# Altium project obc_ver2.PrjPcb (part 1 of 3)
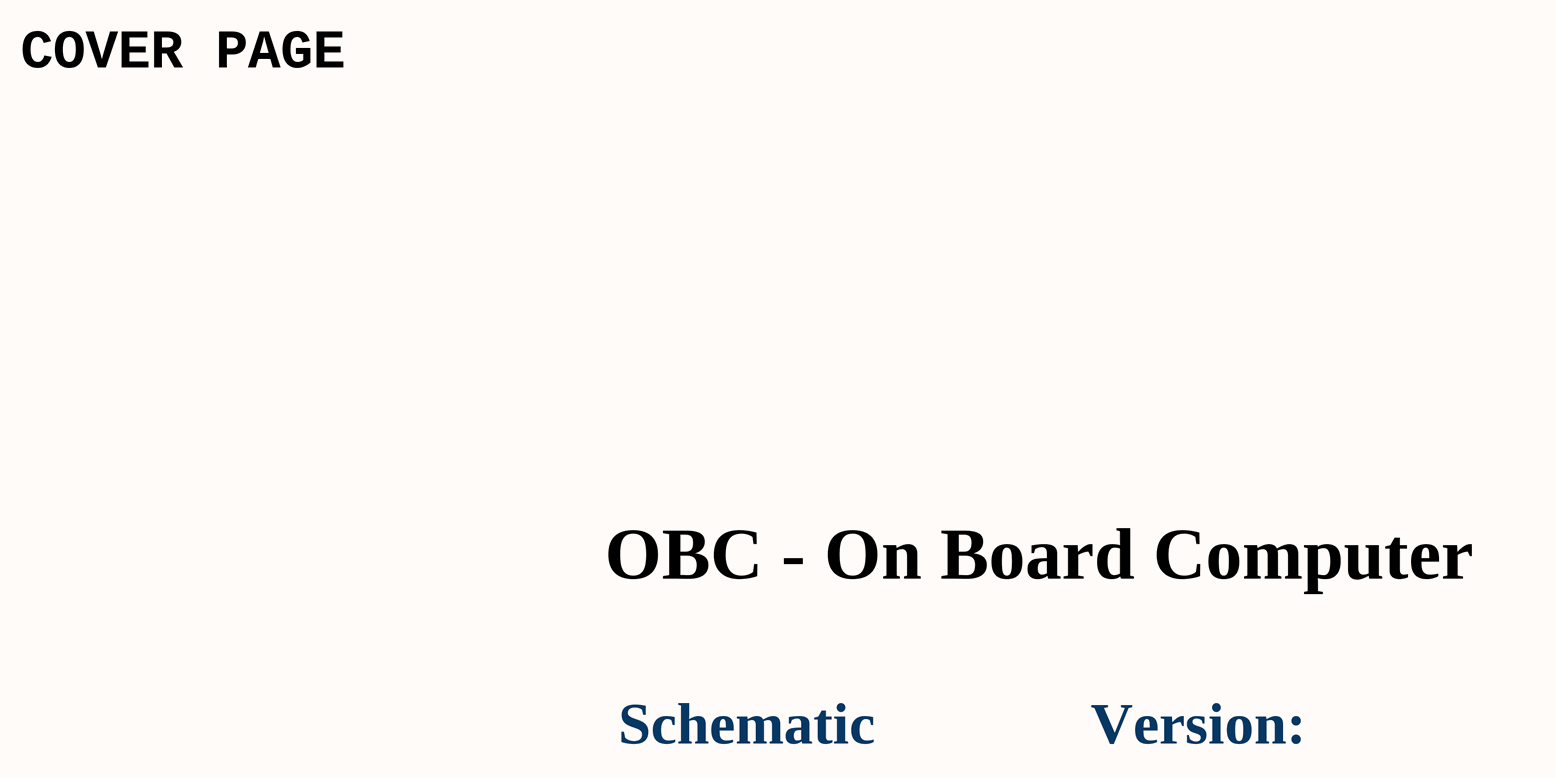
[diagram p0: obc-v2_COVER-PAGE.SchDoc]
21 sheets, 425 parts. Net scope: flat (ports and power ports of the same name join across sheets).
Board file: OBC_Ver2.PcbDoc
Sheets:
  obc-v2_COVER-PAGE.SchDoc
  obc-v2_INDEX.SchDoc
  obc-v2_POWER.SchDoc
  obc-v2_OUT-eMMC.SchDoc
  obc-v2_TMP-eMMC.SchDoc
  obc-v2_RTC-WDOG.SchDoc
  obc-v2_FRAM-FLASH.SchDoc
  obc-v2_BOARD-CONNECT.SchDoc
  obc-v2_DEBUG.SchDoc
  obc-v2_USB-HUB.SchDoc
  obc-v2_EXP-I2C-IRQ.SchDoc
  obc-v2_EXP-CAN-RS422.SchDoc
  obc-v2_CM4-M2.SchDoc
  obc-v2_CM4-PinOut.SchDoc
  obc-v2_CM4-SPI-UART.SchDoc
  obc-v2_CM4-IRQ-CTRL.SchDoc
  obc-v2_CM4-FUNCTION.SchDoc
  obc-v2_CM4-CSI.SchDoc
  obc-v2_CM4-POWER.SchDoc
  obc-v2_MCU-POWER.SchDoc
  obc-v2_MCU-PinOut.SchDoc

## Sheet obc-v2_COVER-PAGE.SchDoc
size 420 x 297 mm; SheetNumber: 1; SheetTotal: 23

### Notes on the sheet
- COVER PAGE
- OBC - On Board Computer
- Schematic
- Version:
- Project:
- Sub-system:
- Design by:
- Sheet title:
- Sheet
- A3
- of
- Checked by:
- Approved by:
- Revision:
- Document No:
- Size:
- Date:

## Sheet obc-v2_INDEX.SchDoc
size 420 x 297 mm; SheetNumber: 2; SheetTotal: 23
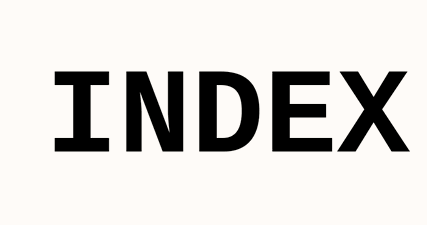
[diagram p1: obc-v2_INDEX.SchDoc]

### Notes on the sheet
- INDEX
- Project:
- Sub-system:
- Design by:
- Sheet title:
- Sheet
- A3
- of
- Checked by:
- Approved by:
- Revision:
- Document No:
- Size:
- Date:

## Sheet obc-v2_POWER.SchDoc
size 420 x 297 mm; SheetNumber: 3; SheetTotal: 21
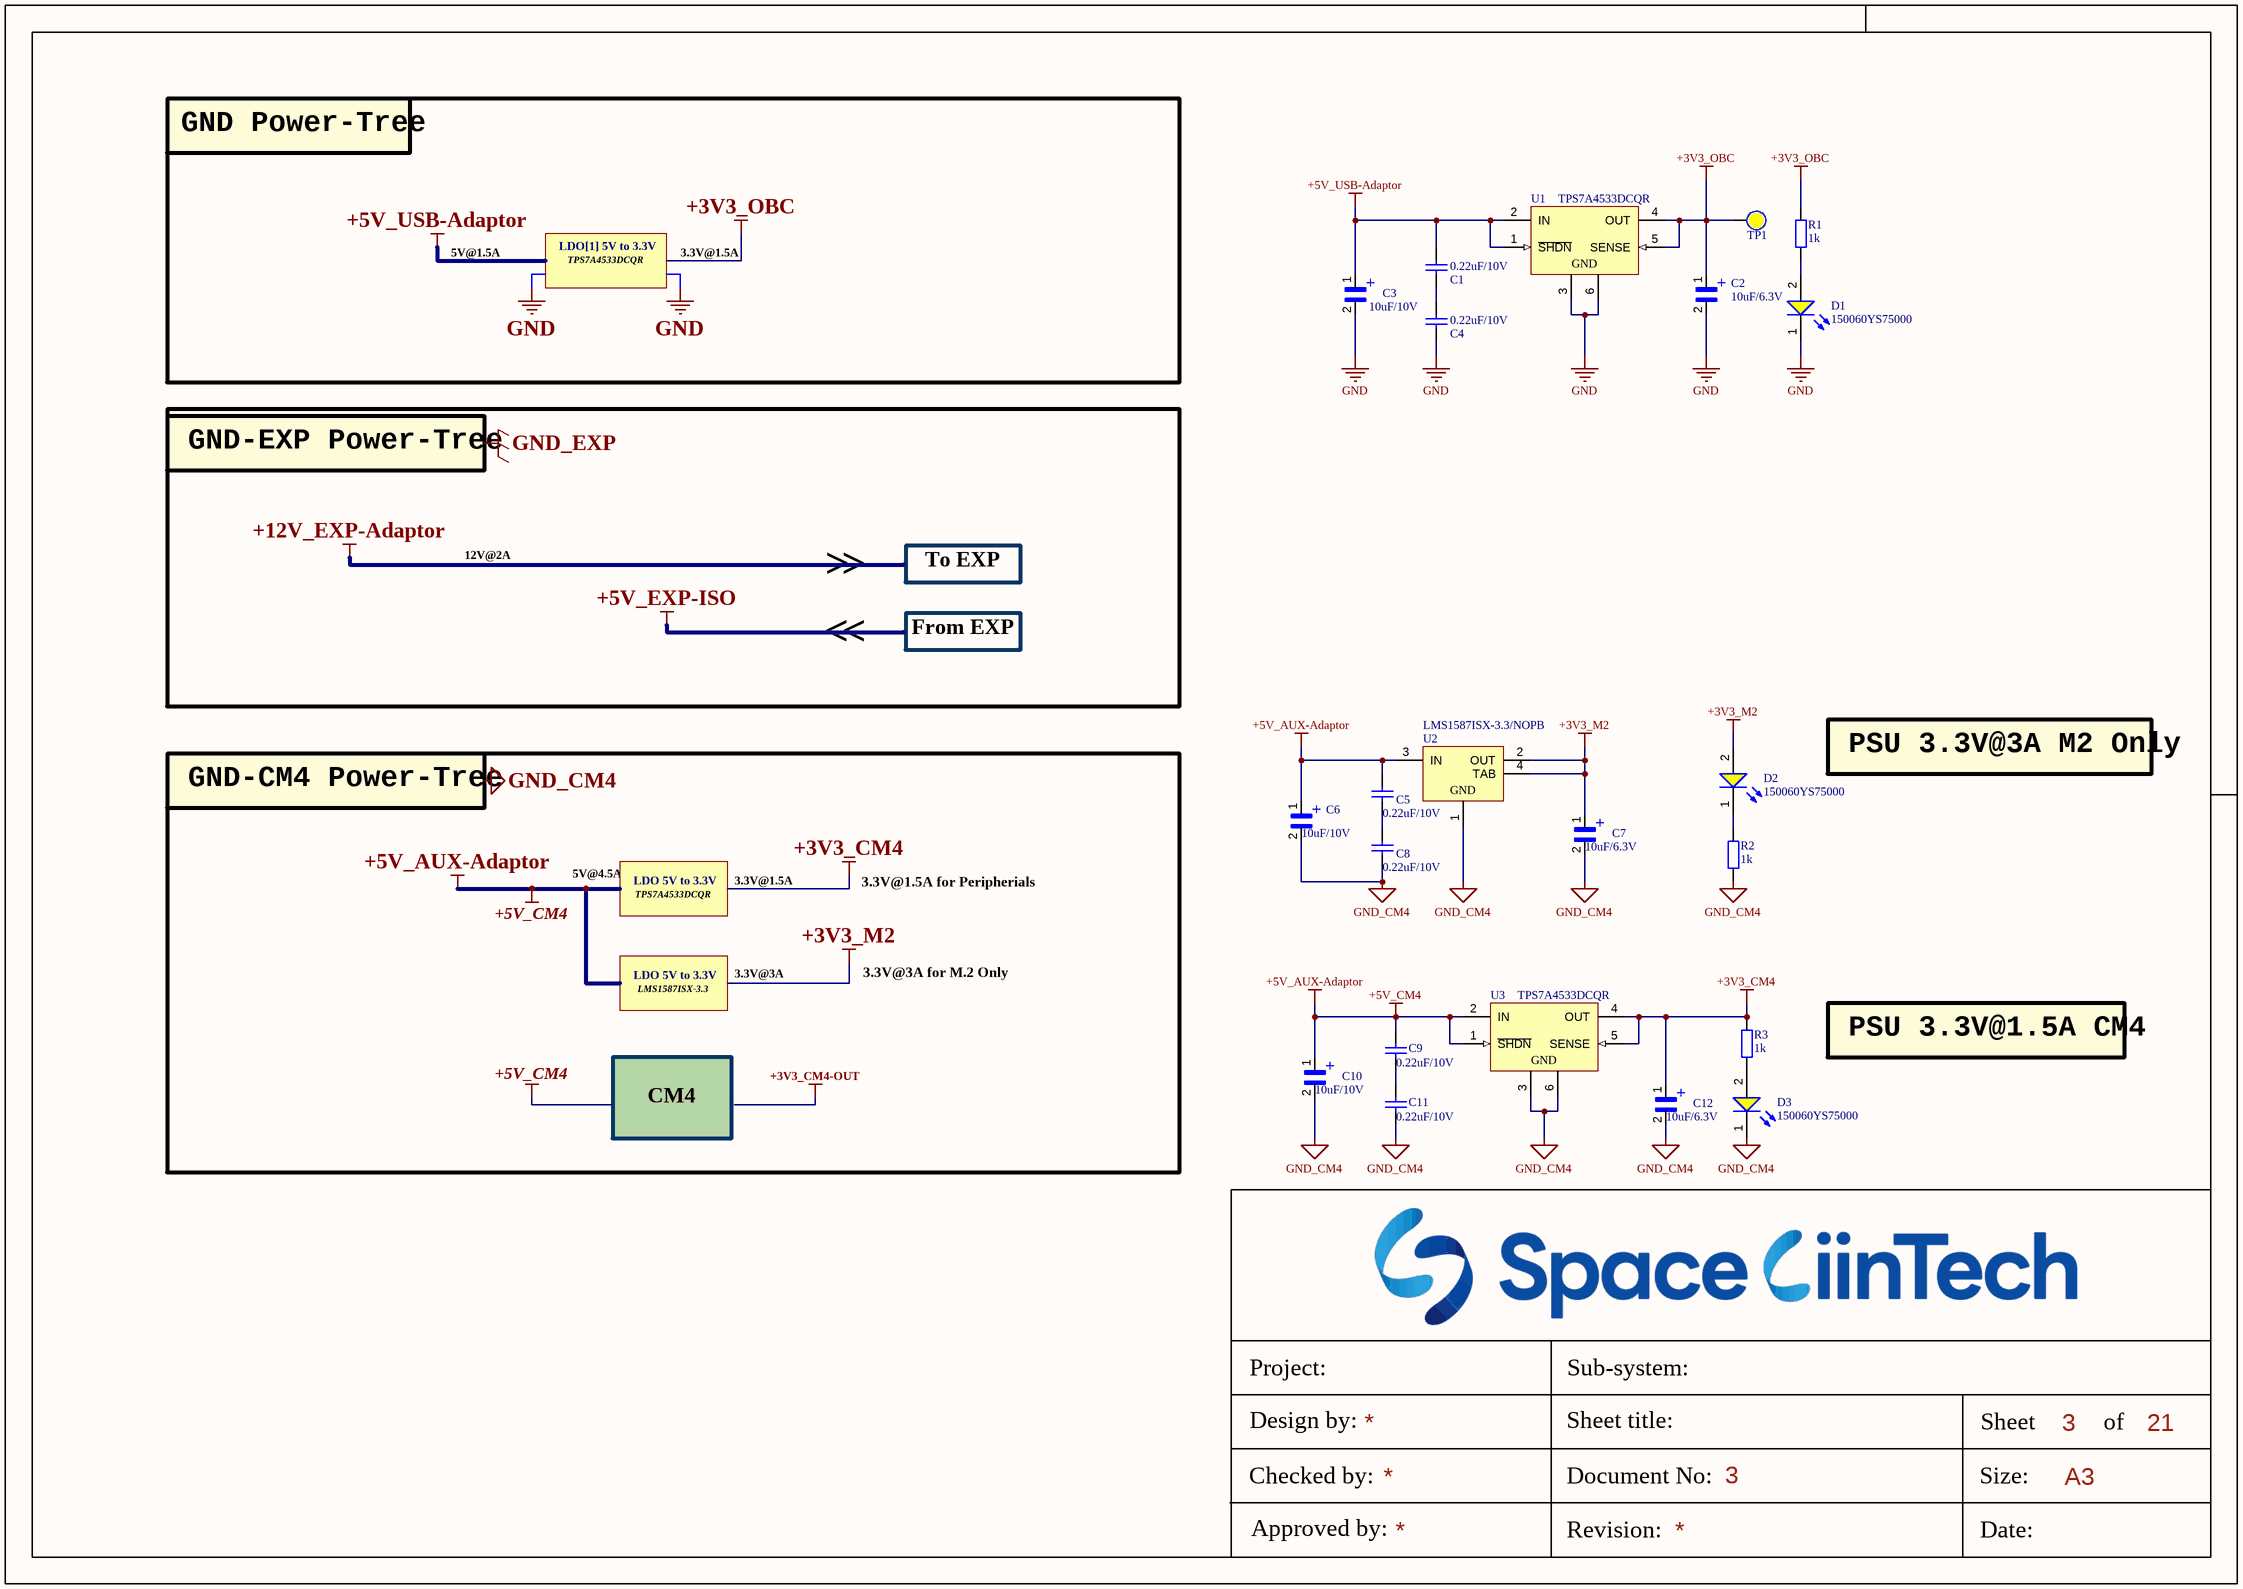
[diagram p2: obc-v2_POWER.SchDoc]

### Parts
C1  0.22uF/10V  [CAP_C_1005X60]
C2  10uF/6.3V  [CAP_MP_2012X170]
C3  10uF/10V  [CAP_MP_2012X170]
C4  0.22uF/10V  [CAP_C_1005X60]
C5  0.22uF/10V  [CAP_C_1005X60]
C6  10uF/10V  [CAP_MP_2012X170]
C7  10uF/6.3V  [CAP_MP_2012X170]
C8  0.22uF/10V  [CAP_C_1005X60]
C9  0.22uF/10V  [CAP_C_1005X60]
C10  10uF/10V  [CAP_MP_2012X170]
C11  0.22uF/10V  [CAP_C_1005X60]
C12  10uF/6.3V  [CAP_MP_2012X170]
D1  150060YS75000  [WL-SMCW_0603_150060xx75000]
D2  150060YS75000  [WL-SMCW_0603_150060xx75000]
D3  150060YS75000  [WL-SMCW_0603_150060xx75000]
R1  1k  [RES_C_1608X60]
R2  1k  [RES_C_1608X60]
R3  1k  [RES_C_1608X60]
TP1  (no value)  [Test Point 1 Side]  (no BOM)
U1  TPS7A4533DCQR  [DCQ0006A_M]
U2  LMS1587ISX-3.3/NOPB  [TS3B_L]
U3  TPS7A4533DCQR  [DCQ0006A_M]

### Nets
+3V3_CM4: C12.1 R3.2 U3.4(OUT) U3.5(SENSE)
+3V3_M2: C7.1 D2.2(A) U2.2(OUT) U2.4(TAB)
+3V3_OBC: C2.1 R1.2 TP1.0 U1.4(OUT) U1.5(SENSE)
+5V_AUX-Adaptor: C5.1 C6.1 C9.1 C10.1 U2.3(IN) U3.1(~{SHDN}) U3.2(IN)  [also labelled +5V_CM4]
+5V_USB-Adaptor: C1.1 C3.1 U1.1(~{SHDN}) U1.2(IN)
GND: C2.2 C3.2 C4.2 D1.1(K) U1.3(GND) U1.6(GND)
GND_CM4: C6.2 C7.2 C8.2 C10.2 C11.2 C12.2 D3.1(K) R2.2 U2.1(GND) U3.3(GND) U3.6(GND)
NetC1_2: C1.2 C4.1
NetC5_2: C5.2 C8.1
NetC9_2: C9.2 C11.1
NetD1_2: D1.2(A) R1.1
NetD2_1: D2.1(K) R2.1
NetD3_2: D3.2(A) R3.1

### Notes on the sheet
- GND Power-Tree
- 5V@1.5A
- LDO[1] 5V to 3.3V
- TPS7A4533DCQR
- 3.3V@1.5A
- GND-EXP Power-Tree
- 12V@2A
- >
- To EXP
- <
- From EXP
- GND-CM4 Power-Tree
- PSU 3.3V@3A M2 Only
- 5V@4.5A
- LDO 5V to 3.3V
- 3.3V@1.5A for Peripherials
- LMS1587ISX-3.3
- 3.3V@3A
- 3.3V@3A for M.2 Only
- PSU 3.3V@1.5A CM4
- CM4
- Labels drawn without touching a wire or pin: GND, GND_CM4, GND_EXP
- Project:
- Sub-system:
- Design by:
- Sheet title:
- Sheet
- A3
- of
- Checked by:
- Approved by:
- Revision:
- Document No:
- Size:
- Date:
- (in symbol TACR686M003RTA) +

### Library data of the parts
C1 C4 C5 C8 C9 C11 = Tu 0402 33nF 10V: CAPC; Chung_Loai: Dán; Don_Vi: Con; So_Chan: 2; Ten_Linh_Kien: Tụ 0402 33nF X7R 10V GRM155R71A333KA01D; Ma_Hang: MH007853; Kieu_Chan: *
C2 C3 C6 C7 C10 C12 = TACR686M003RTA: CAPP; MF: AVX; Availability: Unavailable; SnapEDA_Link: https://www.snapeda.com/parts/TACR686M003RTA/AVX/view-part/1745975/?ref=snap; MP: TACR686M003RTA; Value: *; Price: None; Package: 0805 AVX
D1-D3 = CMP-1426-00005-2: LED YELLOW CLEAR 0603 SMD; NexarPartId: 29687085; Wavelength: 590nm; Luminous Intensity: 120mcd; Peak Wavelength: 595nm; Forward Current: 100mA; Power Dissipation: 72mW; Forward Voltage: 2V; Test Current: 20mA; Reverse Voltage: 5V; Lens Style: Clear, Rectangular; Max Junction Temperature (Tj): 95°C; Viewing Angle: 140°; Case Code (Imperial): 0603; Height: 700µm; REACH SVHC: Unknown; Dominant Wavelength: 590nm; Min Operating Temperature: -40°C; Color: Yellow; Width: 800µm; Mount: Surface Mount; Packaging: Tape and Reel; Max Operating Temperature: 85°C; RoHS: Compliant; Max Reverse Voltage (DC): 5V; Case Code (Metric): 1608; Length: 1.6mm; Case/Package: 0603
R1-R3 = Tro 0603 1% 10k: RES; Chung_Loai: Dán; Don_Vi: Con; So_Chan: 2; Ten_Linh_Kien: Trở 0603 1% 10k; Ma_Hang: MH006333; Kieu_Chan: *
TP1 = Test Point: Solder: NF
U1 U3 = CMP-0395-00360-2: Single Output Fast Transient Response LDO, 1.5 A, Fixed 3.3 V Output, 2.1 to 20 V Input, 6-pin SOT-223 (DCQ), -40 to 125 degC, Green (RoHS & no Sb/Br); Manufacturer: Texas Instruments; Vout Adj(Max)(V): 3.3; Vin(Max)(V): 20; Accuracy(%): 1; SubFamily: Single Channel LDO; Vin(Min)(V): 2.1; Iout(Max)(A): 1.5; Vdo(Typ)(mV): 300; Eco-Plan: Green (RoHS & no Sb/Br); Mounting Technology: Surface Mount; PackageDescription: 6-Pin Plastic Small Outline, Body 3.5 x 6.5 mm, Pitch 1.27 mm; ComponentLink2URL: http://www.ti.com/general/docs/lit/getliterature.tsp?genericPartNumber=TPS7A4533&fileType=pdf; PackageReference: DCQ0006A; ComponentLink3Description: Package Specification; ComponentLink2Description: Datasheet; Fixed Output Options(V): 3.3; Iq(Typ)(mA): 1; ComponentLink1URL: http://www.ti.com/; PartNumber: TPS7A4533DCQR; ComponentLink1Description: Manufacturer URL; PackageVersion: 4202109/D; Vout Adj(Min)(V): 3.3; DatasheetVersion: SLVS720D; ComponentLink3URL: http://www.ti.com/litv/pdf/mpds098c
U2 = CMP-0062-00180-3: 3A Low Dropout Fast Response Regulators, 3-pin TO-263, Pb-Free; Manufacturer: National Semiconductor; PowerWise: N; High-Reliability: Y; PackageTopMarking: NSUZXYTTE#*LMS1587*IS-3.3; CompType: LDO IC; ComponentLink1Description: Manufacturer URL; PackageReference: TS3B; ComponentLink1URL: http://www.national.com/; ComponentLink2URL: http://www.national.com/ds/LM/LMS1587.pdf; DatasheetVersion: Jun-2005; ComponentLink3URL: http://www.national.com/pf/LM/LMS1587.html; PartNumber: LMS1587ISX-3.3/NOPB; RevisionNote: SCH symbol layout adjusted; PinCount: 3; RoHS: Y; Code_JEDEC: MO-169-AA; PackageDescription: TO-263, Molded, .400 x .390 x .180in, 3 Lead, .1in Pitch, Surface Mount; ComponentLink4Description: TS3B Package Page; ComponentLink3Description: LMS1587 Web Page; PackageVersion: revF, Apr-2005; ComponentLink2Description: LMS1587 Datasheet; ComponentLink4URL: http://www.national.com/packaging/folders/ts3b.html

## Sheet obc-v2_OUT-eMMC.SchDoc
size 420 x 297 mm; SheetNumber: 4; SheetTotal: 21
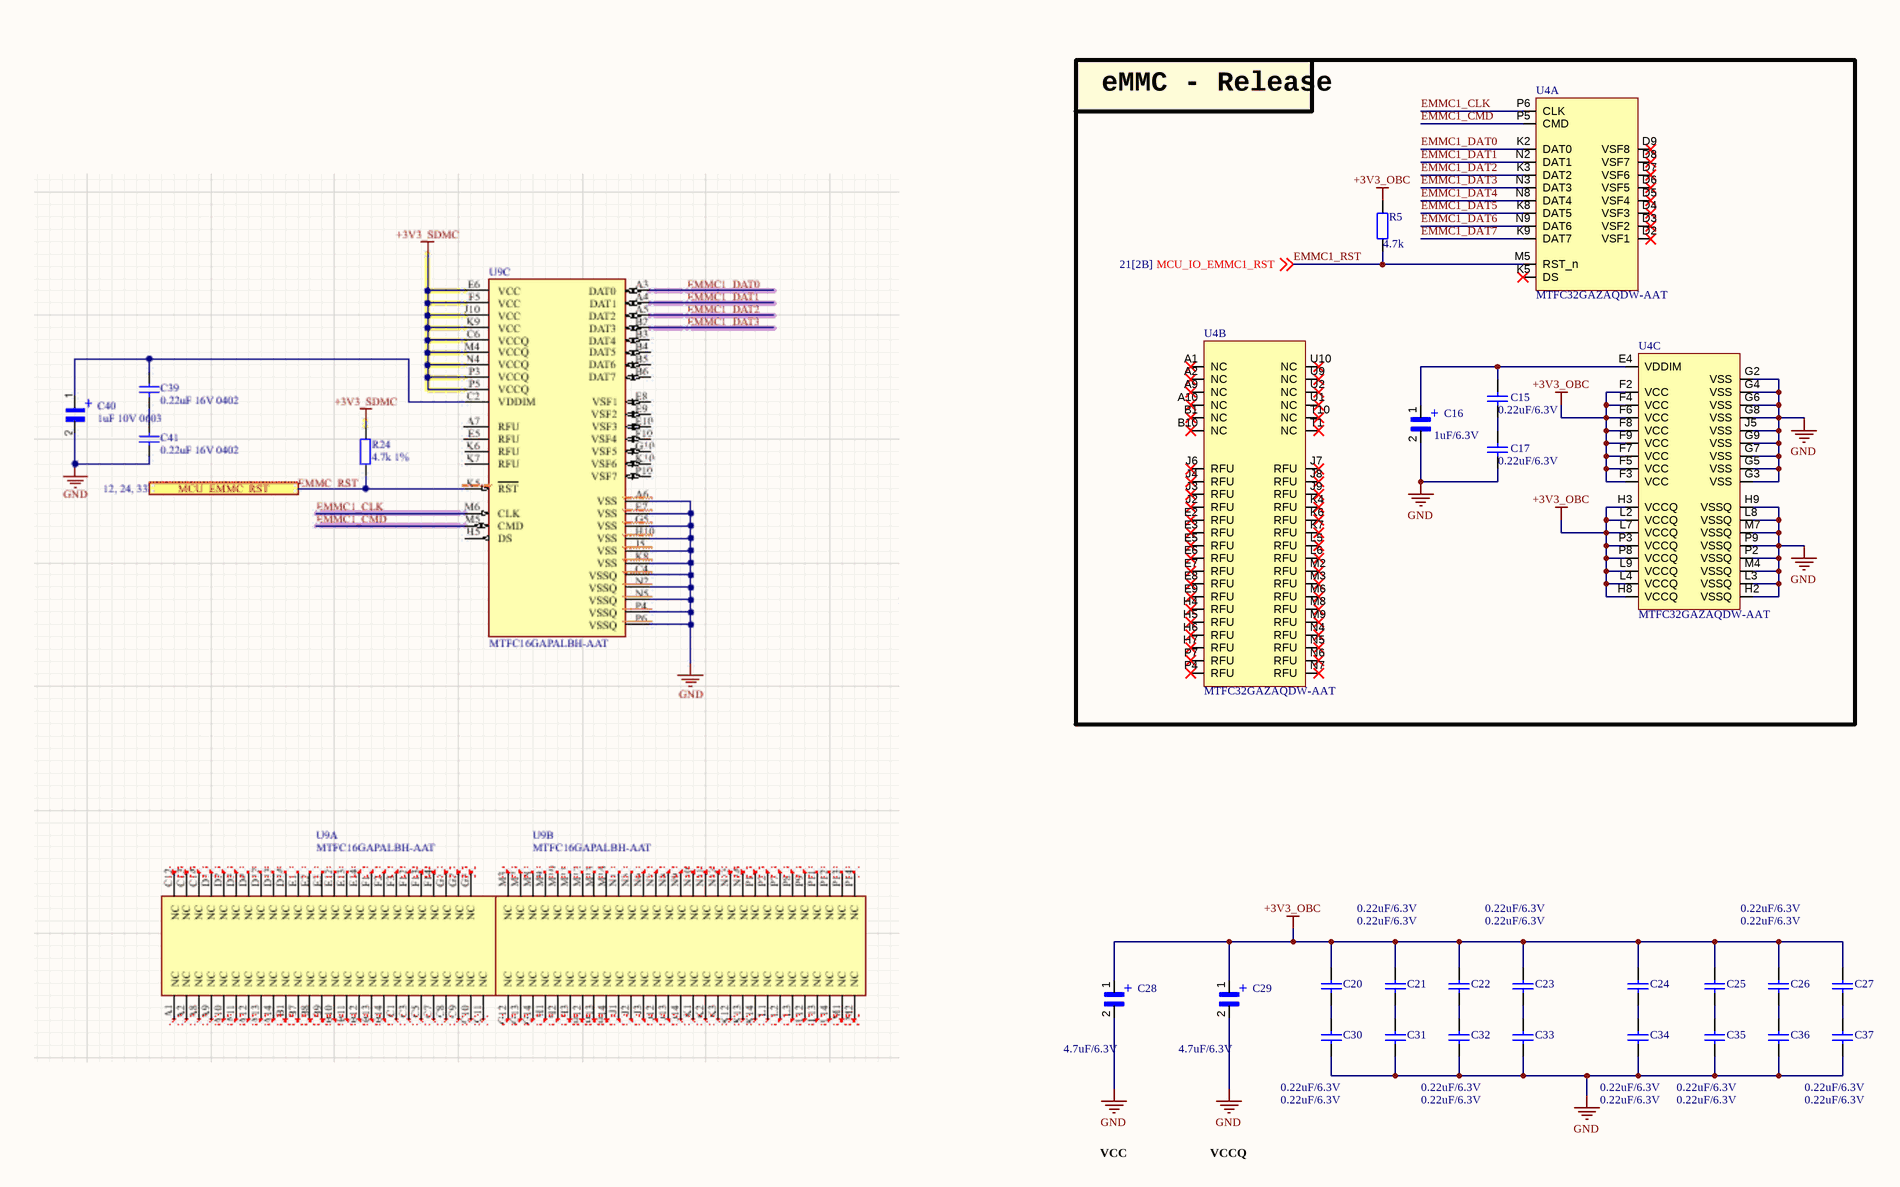
[diagram p3: obc-v2_OUT-eMMC.SchDoc, left]
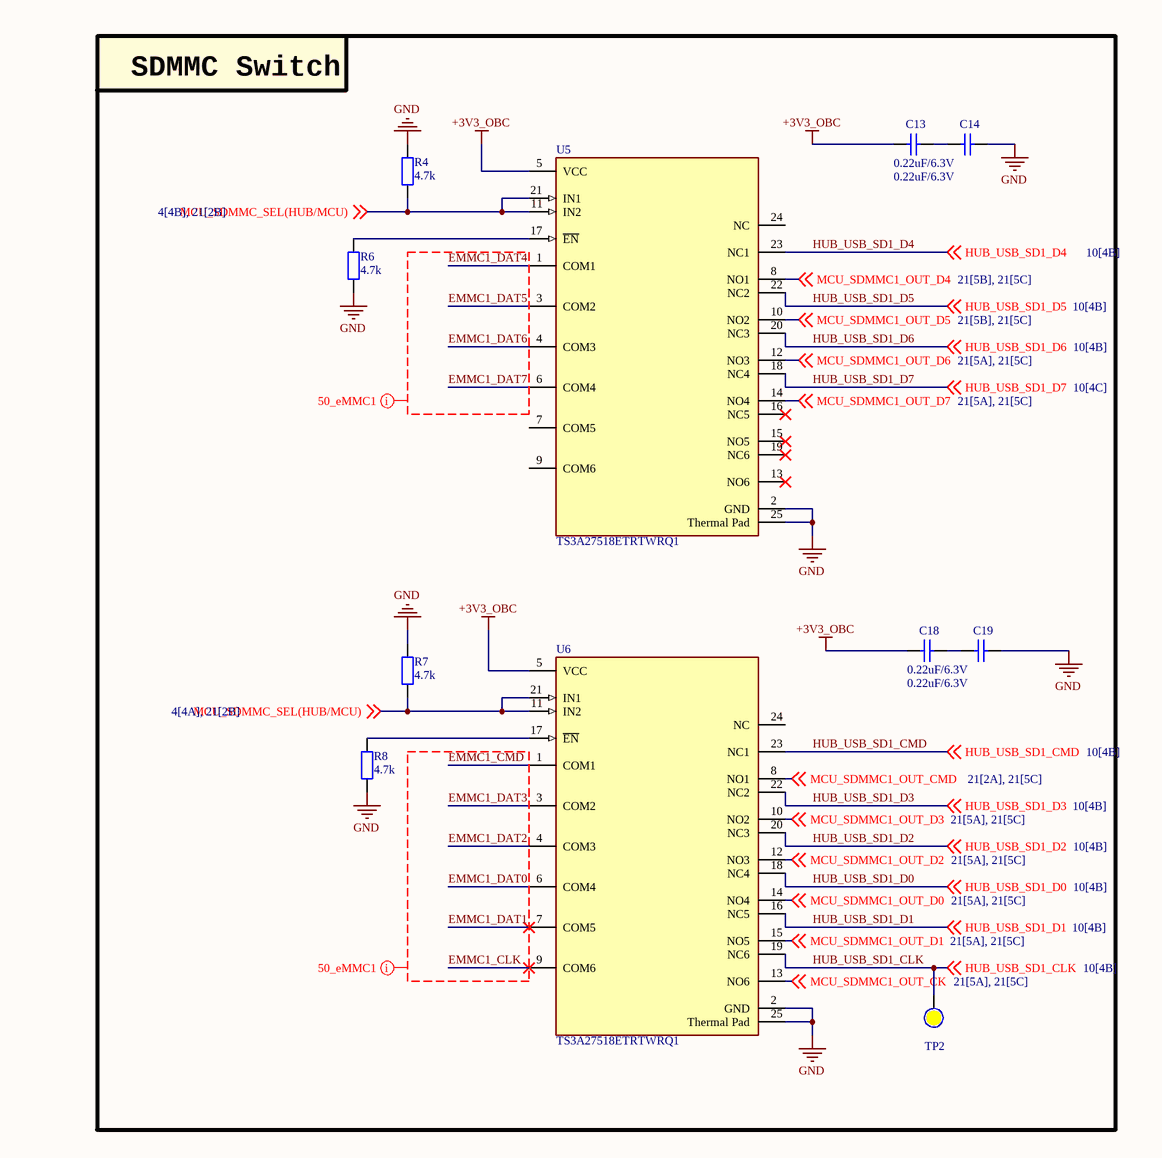
[diagram p4: obc-v2_OUT-eMMC.SchDoc, right]

### Parts
C13  0.22uF/6.3V  [CAP_C_1005X60]
C14  0.22uF/6.3V  [CAP_C_1005X60]
C15  0.22uF/6.3V  [CAP_C_1005X60]
C16  1uF/6.3V  [CAP_MP_1608X90]
C17  0.22uF/6.3V  [CAP_C_1005X60]
C18  0.22uF/6.3V  [CAP_C_1005X60]
C19  0.22uF/6.3V  [CAP_C_1005X60]
C20  0.22uF/6.3V  [CAP_C_1005X60]
C21  0.22uF/6.3V  [CAP_C_1005X60]
C22  0.22uF/6.3V  [CAP_C_1005X60]
C23  0.22uF/6.3V  [CAP_C_1005X60]
C24  0.22uF/6.3V  [CAP_C_1005X60]
C25  0.22uF/6.3V  [CAP_C_1005X60]
C26  0.22uF/6.3V  [CAP_C_1005X60]
C27  0.22uF/6.3V  [CAP_C_1005X60]
C28  4.7uF/6.3V  [CAP_MP_1608X90]
C29  4.7uF/6.3V  [CAP_MP_1608X90]
C30  0.22uF/6.3V  [CAP_C_1005X60]
C31  0.22uF/6.3V  [CAP_C_1005X60]
C32  0.22uF/6.3V  [CAP_C_1005X60]
C33  0.22uF/6.3V  [CAP_C_1005X60]
C34  0.22uF/6.3V  [CAP_C_1005X60]
C35  0.22uF/6.3V  [CAP_C_1005X60]
C36  0.22uF/6.3V  [CAP_C_1005X60]
C37  0.22uF/6.3V  [CAP_C_1005X60]
R4  4.7k  [RES_C_1608X60]
R5  4.7k  [RES_C_1608X60]
R6  4.7k  [RES_C_1608X60]
R7  4.7k  [RES_C_1608X60]
R8  4.7k  [RES_C_1608X60]
TP2  (no value)  [Test Point 1 Side]  (no BOM)
U4  MTFC32GAZAQDW-AAT  [BGA_100_C_100P_10X17_1400X1800X150]  (parts A,B,C of 3)
U5  TS3A27518ETRTWRQ1  [FP-RTW0024B-IPC_A]
U6  TS3A27518ETRTWRQ1  [FP-RTW0024B-IPC_A]

### Blocks framed on the sheet
eMMC - Release: C15-C17 R5 U4
SDMMC Switch: C13 C14 C18 C19 R4 R6-R8 TP2 U5 U6

### Nets
+3V3_OBC: C13.2 C18.2 C20.1 C21.1 C22.1 C23.1 C24.1 C25.1 C26.1 C27.1 C28.1 C29.1 R5.1 U4.F2(VCC) U4.F3(VCC) U4.F4(VCC) U4.F5(VCC) U4.F6(VCC) U4.F7(VCC) U4.F8(VCC) U4.F9(VCC) U4.H3(VCCQ) U4.H8(VCCQ) U4.L2(VCCQ) U4.L4(VCCQ) U4.L7(VCCQ) U4.L9(VCCQ) U4.P3(VCCQ) U4.P8(VCCQ) U5.5(VCC) U6.5(VCC)
GND: C14.1 C16.2 C17.2 C19.1 C28.2 C29.2 C30.2 C31.2 C32.2 C33.2 C34.2 C35.2 C36.2 C37.2 R4.1 R6.2 R7.1 R8.2 U4.G2(VSS) U4.G3(VSS) U4.G4(VSS) U4.G5(VSS) U4.G6(VSS) U4.G7(VSS) U4.G8(VSS) U4.G9(VSS) U4.H2(VSSQ) U4.H9(VSSQ) U4.J5(VSS) U4.L3(VSSQ) U4.L8(VSSQ) U4.M4(VSSQ) U4.M7(VSSQ) U4.P2(VSSQ) U4.P9(VSSQ) U5.2(GND) U5.25(Thermal_Pad) U6.2(GND) U6.25(Thermal_Pad)
EMMC1_CLK: U4.P6(CLK) U6.9(COM6)
EMMC1_CMD: U4.P5(CMD) U6.1(COM1)
EMMC1_DAT0: U4.K2(DAT0) U6.6(COM4)
EMMC1_DAT1: U4.N2(DAT1) U6.7(COM5)
EMMC1_DAT2: U4.K3(DAT2) U6.4(COM3)
EMMC1_DAT3: U4.N3(DAT3) U6.3(COM2)
EMMC1_DAT4: U4.N8(DAT4) U5.1(COM1)
EMMC1_DAT5: U4.K8(DAT5) U5.3(COM2)
EMMC1_DAT6: U4.N9(DAT6) U5.4(COM3)
EMMC1_DAT7: U4.K9(DAT7) U5.6(COM4)
EMMC1_RST: R5.2 U4.M5(RST_n) ; off-sheet MCU_IO_EMMC1_RST  [also labelled MCU_IO_EMMC1_RST]
HUB_USB_SD1_CLK: TP2.0 U6.19(NC6) ; off-sheet HUB_USB_SD1_CLK  [project net HUB_SDMMC1_CLK]
HUB_USB_SD1_CMD: U6.23(NC1) ; off-sheet HUB_USB_SD1_CMD  [project net HUB_SDMMC1_CMD]
HUB_USB_SD1_D0: U6.18(NC4) ; off-sheet HUB_USB_SD1_D0  [project net HUB_SDMMC1_D0]
HUB_USB_SD1_D1: U6.16(NC5) ; off-sheet HUB_USB_SD1_D1  [project net HUB_SDMMC1_D1]
HUB_USB_SD1_D2: U6.20(NC3) ; off-sheet HUB_USB_SD1_D2  [project net HUB_SDMMC1_D2]
HUB_USB_SD1_D3: U6.22(NC2) ; off-sheet HUB_USB_SD1_D3  [project net HUB_SDMMC1_D3]
HUB_USB_SD1_D4: U5.23(NC1) ; off-sheet HUB_USB_SD1_D4  [project net HUB_SDMMC1_D4]
HUB_USB_SD1_D5: U5.22(NC2) ; off-sheet HUB_USB_SD1_D5  [project net HUB_SDMMC1_D5]
HUB_USB_SD1_D6: U5.20(NC3) ; off-sheet HUB_USB_SD1_D6  [project net HUB_SDMMC1_D6]
HUB_USB_SD1_D7: U5.18(NC4) ; off-sheet HUB_USB_SD1_D7  [project net HUB_SDMMC1_D7]
MCU_SDMMC1_OUT_CK: U6.13(NO6) ; off-sheet MCU_SDMMC1_OUT_CK
MCU_SDMMC1_OUT_CMD: U6.8(NO1) ; off-sheet MCU_SDMMC1_OUT_CMD
MCU_SDMMC1_OUT_D0: U6.14(NO4) ; off-sheet MCU_SDMMC1_OUT_D0
MCU_SDMMC1_OUT_D1: U6.15(NO5) ; off-sheet MCU_SDMMC1_OUT_D1
MCU_SDMMC1_OUT_D2: U6.12(NO3) ; off-sheet MCU_SDMMC1_OUT_D2
MCU_SDMMC1_OUT_D3: U6.10(NO2) ; off-sheet MCU_SDMMC1_OUT_D3
MCU_SDMMC1_OUT_D4: U5.8(NO1) ; off-sheet MCU_SDMMC1_OUT_D4
MCU_SDMMC1_OUT_D5: U5.10(NO2) ; off-sheet MCU_SDMMC1_OUT_D5
MCU_SDMMC1_OUT_D6: U5.12(NO3) ; off-sheet MCU_SDMMC1_OUT_D6
MCU_SDMMC1_OUT_D7: U5.14(NO4) ; off-sheet MCU_SDMMC1_OUT_D7
MCU_SDMMC_SEL(HUB/MCU): R4.2 R7.2 U5.11(IN2) U5.21(IN1) U6.11(IN2) U6.21(IN1) ; off-sheet MCU_SDMMC_SEL(HUB/MCU)
NetC13_1: C13.1 C14.2
NetC15_1: C15.1 C16.1 U4.E4(VDDIM)
NetC15_2: C15.2 C17.1
NetC18_1: C18.1 C19.2
NetC20_2: C20.2 C30.1
NetC21_2: C21.2 C31.1
NetC22_2: C22.2 C32.1
NetC23_2: C23.2 C33.1
NetC24_2: C24.2 C34.1
NetC25_2: C25.2 C35.1
NetC26_2: C26.2 C36.1
NetC27_2: C27.2 C37.1
NetR6_1: R6.1 U5.17(~{EN})
NetR8_1: R8.1 U6.17(~{EN})

Not connected (* = marked no-connect by the designer): U4 A1(NC)* A2(NC)* A9(NC)* A10(NC)* B1(NC)* B10(NC)* D2(VSF1)* D3(VSF2)* D4(VSF3)* D5(VSF4)* D6(VSF5)* D7(VSF6)* D8(VSF7)* D9(VSF8)* E2(RFU)* E3(RFU)* E5(RFU)* E6(RFU)* E7(RFU)* E8(RFU)* E9(RFU)* H4(RFU)* H5(RFU)* H6(RFU)* H7(RFU)* J2(RFU)* J3(RFU)* J4(RFU)* J6(RFU)* J7(RFU)* J8(RFU)* J9(RFU)* K4(RFU)* K5(DS)* K6(RFU)* K7(RFU)* L5(RFU)* L6(RFU)* M2(RFU)* M3(RFU)* M6(RFU)* M8(RFU)* M9(RFU)* N4(RFU)* N5(RFU)* N6(RFU)* N7(RFU)* P4(RFU)* P7(RFU)* T1(NC)* T10(NC)* U1(NC)* U2(NC)* U9(NC)* U10(NC)*; U5 7(COM5) 9(COM6) 13(NO6)* 15(NO5)* 16(NC5)* 19(NC6)* 24(NC); U6 24(NC)

### Layout directives
net class 50_eMMC1: EMMC1_CLK, EMMC1_CMD, EMMC1_DAT0, EMMC1_DAT1, EMMC1_DAT2, EMMC1_DAT3, EMMC1_DAT4, EMMC1_DAT5, EMMC1_DAT6, EMMC1_DAT7

### Notes on the sheet
- VCC
- VCCQ
- Project:
- Sub-system:
- Design by:
- Sheet title:
- Sheet
- A3
- of
- Checked by:
- Approved by:
- Revision:
- Document No:
- Size:
- Date:
- (in symbol TACL335M003RTA) +

### Library data of the parts
C13-C15 C17-C27 C30-C37 = Tu 0402 33nF 10V: as C1 on sheet obc-v2_POWER; Kieu_Chan: *
C16 C28 C29 = TACL335M003RTA: CAPP; Package: None; Price: None; Value: *; MP: TACL335M003RTA; Availability: Unavailable
R4-R8 = Tro 0603 1% 10k: as R1 on sheet obc-v2_POWER; Kieu_Chan: *
TP2 = Test Point: Solder: NF
U5 U6 = CMP-04892-000110-1: IC MUX/DEMUX 1X2 24WQFN; Supply Type: Single; Max Supply Voltage: 3.6V; Number of Circuits: 6; On-State Resistance: 6.2R; Turn-Off Delay Time: 70ns; -3db Bandwidth: 240MHz; Operating Supply Current: 40nA; Min Supply Voltage: 1.65V; Logic Function: Multiplexer; Turn-On Delay Time: 68ns; Min Operating Temperature: -40°C; Packaging: Tape and Reel; Case/Package: QFN; Package Quantity: 1; RoHS Compliant: Yes; Lead Free: Lead Free; Bandwidth: 240MHz; Max Operating Temperature: 105°C; Number of Channels: 6; Series: Automotive, AEC-Q100; Number of Pins: 24; Mount: Surface Mount

## Sheet obc-v2_TMP-eMMC.SchDoc
size 420 x 297 mm; SheetNumber: 6; SheetTotal: 23
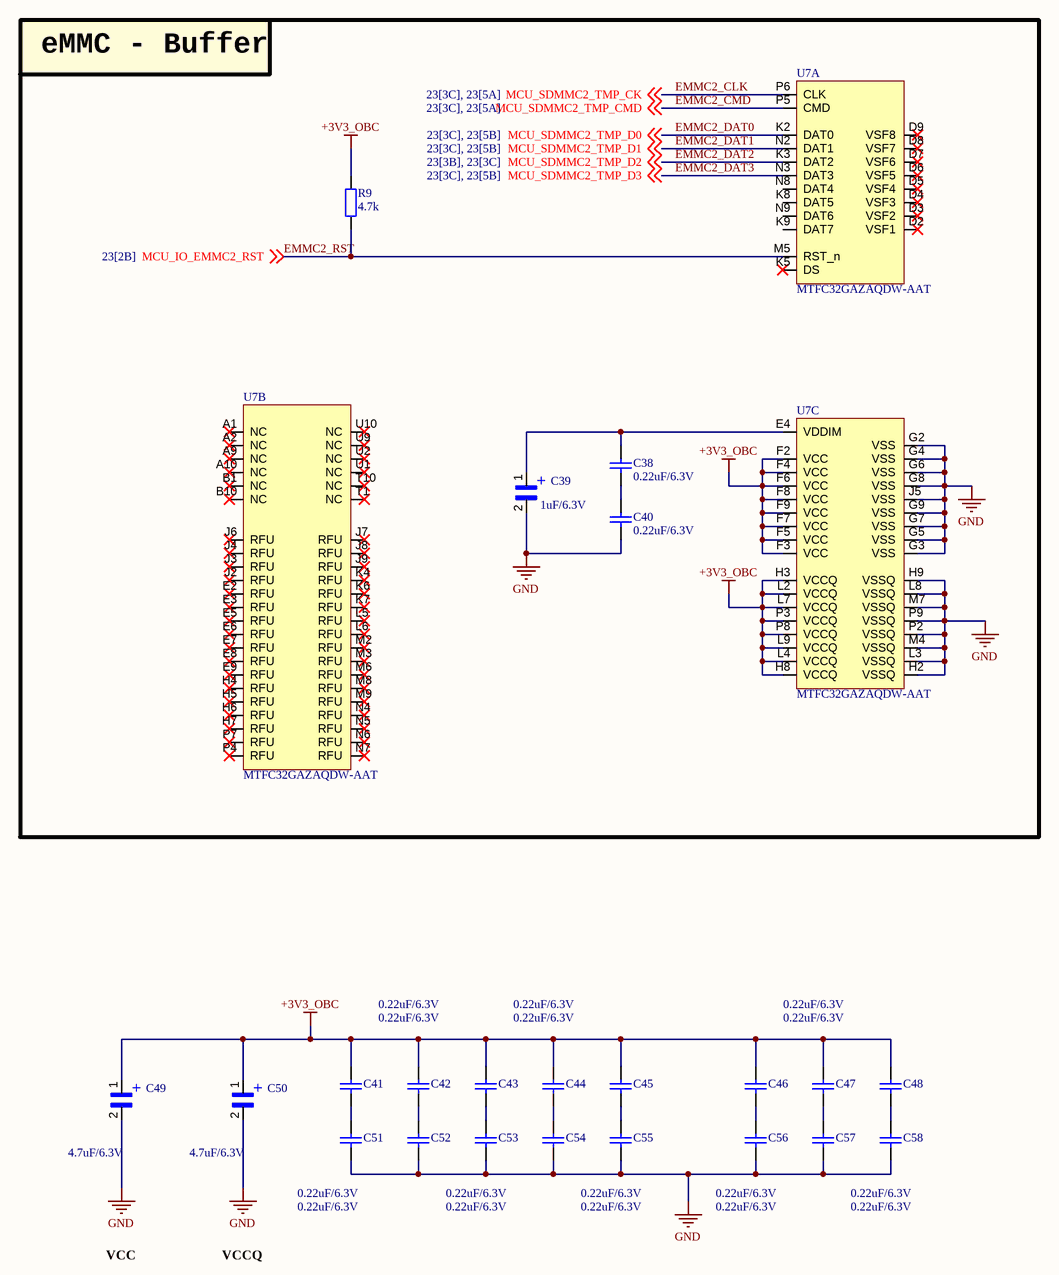
[diagram p5: obc-v2_TMP-eMMC.SchDoc]

### Parts
C38  0.22uF/6.3V  [CAP_C_1005X60]
C39  1uF/6.3V  [CAP_MP_1608X90]
C40  0.22uF/6.3V  [CAP_C_1005X60]
C41  0.22uF/6.3V  [CAP_C_1005X60]
C42  0.22uF/6.3V  [CAP_C_1005X60]
C43  0.22uF/6.3V  [CAP_C_1005X60]
C44  0.22uF/6.3V  [CAP_C_1005X60]
C45  0.22uF/6.3V  [CAP_C_1005X60]
C46  0.22uF/6.3V  [CAP_C_1005X60]
C47  0.22uF/6.3V  [CAP_C_1005X60]
C48  0.22uF/6.3V  [CAP_C_1005X60]
C49  4.7uF/6.3V  [CAP_MP_1608X90]
C50  4.7uF/6.3V  [CAP_MP_1608X90]
C51  0.22uF/6.3V  [CAP_C_1005X60]
C52  0.22uF/6.3V  [CAP_C_1005X60]
C53  0.22uF/6.3V  [CAP_C_1005X60]
C54  0.22uF/6.3V  [CAP_C_1005X60]
C55  0.22uF/6.3V  [CAP_C_1005X60]
C56  0.22uF/6.3V  [CAP_C_1005X60]
C57  0.22uF/6.3V  [CAP_C_1005X60]
C58  0.22uF/6.3V  [CAP_C_1005X60]
R9  4.7k  [RES_C_1608X60]
U7  MTFC32GAZAQDW-AAT  [BGA_100_C_100P_10X17_1400X1800X150]  (parts A,B,C of 3)

### Blocks framed on the sheet
eMMC - Buffer: C38-C40 R9 U7

### Nets
+3V3_OBC: C41.1 C42.1 C43.1 C44.1 C45.1 C46.1 C47.1 C48.1 C49.1 C50.1 R9.1 U7.F2(VCC) U7.F3(VCC) U7.F4(VCC) U7.F5(VCC) U7.F6(VCC) U7.F7(VCC) U7.F8(VCC) U7.F9(VCC) U7.H3(VCCQ) U7.H8(VCCQ) U7.L2(VCCQ) U7.L4(VCCQ) U7.L7(VCCQ) U7.L9(VCCQ) U7.P3(VCCQ) U7.P8(VCCQ)
GND: C39.2 C40.2 C49.2 C50.2 C51.2 C52.2 C53.2 C54.2 C55.2 C56.2 C57.2 C58.2 U7.G2(VSS) U7.G3(VSS) U7.G4(VSS) U7.G5(VSS) U7.G6(VSS) U7.G7(VSS) U7.G8(VSS) U7.G9(VSS) U7.H2(VSSQ) U7.H9(VSSQ) U7.J5(VSS) U7.L3(VSSQ) U7.L8(VSSQ) U7.M4(VSSQ) U7.M7(VSSQ) U7.P2(VSSQ) U7.P9(VSSQ)
EMMC2_CLK: U7.P6(CLK) ; off-sheet MCU_SDMMC2_TMP_CK  [also labelled MCU_SDMMC2_TMP_CK]
EMMC2_CMD: U7.P5(CMD) ; off-sheet MCU_SDMMC2_TMP_CMD  [also labelled MCU_SDMMC2_TMP_CMD]
EMMC2_DAT0: U7.K2(DAT0) ; off-sheet MCU_SDMMC2_TMP_D0  [also labelled MCU_SDMMC2_TMP_D0]
EMMC2_DAT1: U7.N2(DAT1) ; off-sheet MCU_SDMMC2_TMP_D1  [also labelled MCU_SDMMC2_TMP_D1]
EMMC2_DAT2: U7.K3(DAT2) ; off-sheet MCU_SDMMC2_TMP_D2  [also labelled MCU_SDMMC2_TMP_D2]
EMMC2_DAT3: U7.N3(DAT3) ; off-sheet MCU_SDMMC2_TMP_D3  [also labelled MCU_SDMMC2_TMP_D3]
EMMC2_RST: R9.2 U7.M5(RST_n) ; off-sheet MCU_IO_EMMC2_RST  [also labelled MCU_IO_EMMC2_RST]
NetC38_1: C38.1 C39.1 U7.E4(VDDIM)
NetC38_2: C38.2 C40.1
NetC41_2: C41.2 C51.1
NetC42_2: C42.2 C52.1
NetC43_2: C43.2 C53.1
NetC44_2: C44.2 C54.1
NetC45_2: C45.2 C55.1
NetC46_2: C46.2 C56.1
NetC47_2: C47.2 C57.1
NetC48_2: C48.2 C58.1

Not connected (* = marked no-connect by the designer): U7 A1(NC)* A2(NC)* A9(NC)* A10(NC)* B1(NC)* B10(NC)* D2(VSF1)* D3(VSF2)* D4(VSF3)* D5(VSF4)* D6(VSF5)* D7(VSF6)* D8(VSF7)* D9(VSF8)* E2(RFU)* E3(RFU)* E5(RFU)* E6(RFU)* E7(RFU)* E8(RFU)* E9(RFU)* H4(RFU)* H5(RFU)* H6(RFU)* H7(RFU)* J2(RFU)* J3(RFU)* J4(RFU)* J6(RFU)* J7(RFU)* J8(RFU)* J9(RFU)* K4(RFU)* K5(DS)* K6(RFU)* K7(RFU)* K8(DAT5) K9(DAT7) L5(RFU)* L6(RFU)* M2(RFU)* M3(RFU)* M6(RFU)* M8(RFU)* M9(RFU)* N4(RFU)* N5(RFU)* N6(RFU)* N7(RFU)* N8(DAT4) N9(DAT6) P4(RFU)* P7(RFU)* T1(NC)* T10(NC)* U1(NC)* U2(NC)* U9(NC)* U10(NC)*

### Notes on the sheet
- VCC
- VCCQ
- Project:
- Sub-system:
- Design by:
- Sheet title:
- Sheet
- A3
- of
- Checked by:
- Approved by:
- Revision:
- Document No:
- Size:
- Date:
- (in symbol TACL335M003RTA) +

### Library data of the parts
C38 C40-C48 C51-C58 = Tu 0402 33nF 10V: as C1 on sheet obc-v2_POWER; Kieu_Chan: *
C39 C49 C50 = TACL335M003RTA: CAPP; Package: None; Price: None; Value: *; MP: TACL335M003RTA; Availability: Unavailable
R9 = Tro 0603 1% 10k: as R1 on sheet obc-v2_POWER; Kieu_Chan: *

## Sheet obc-v2_RTC-WDOG.SchDoc
size 420 x 297 mm; SheetNumber: 7; SheetTotal: 23
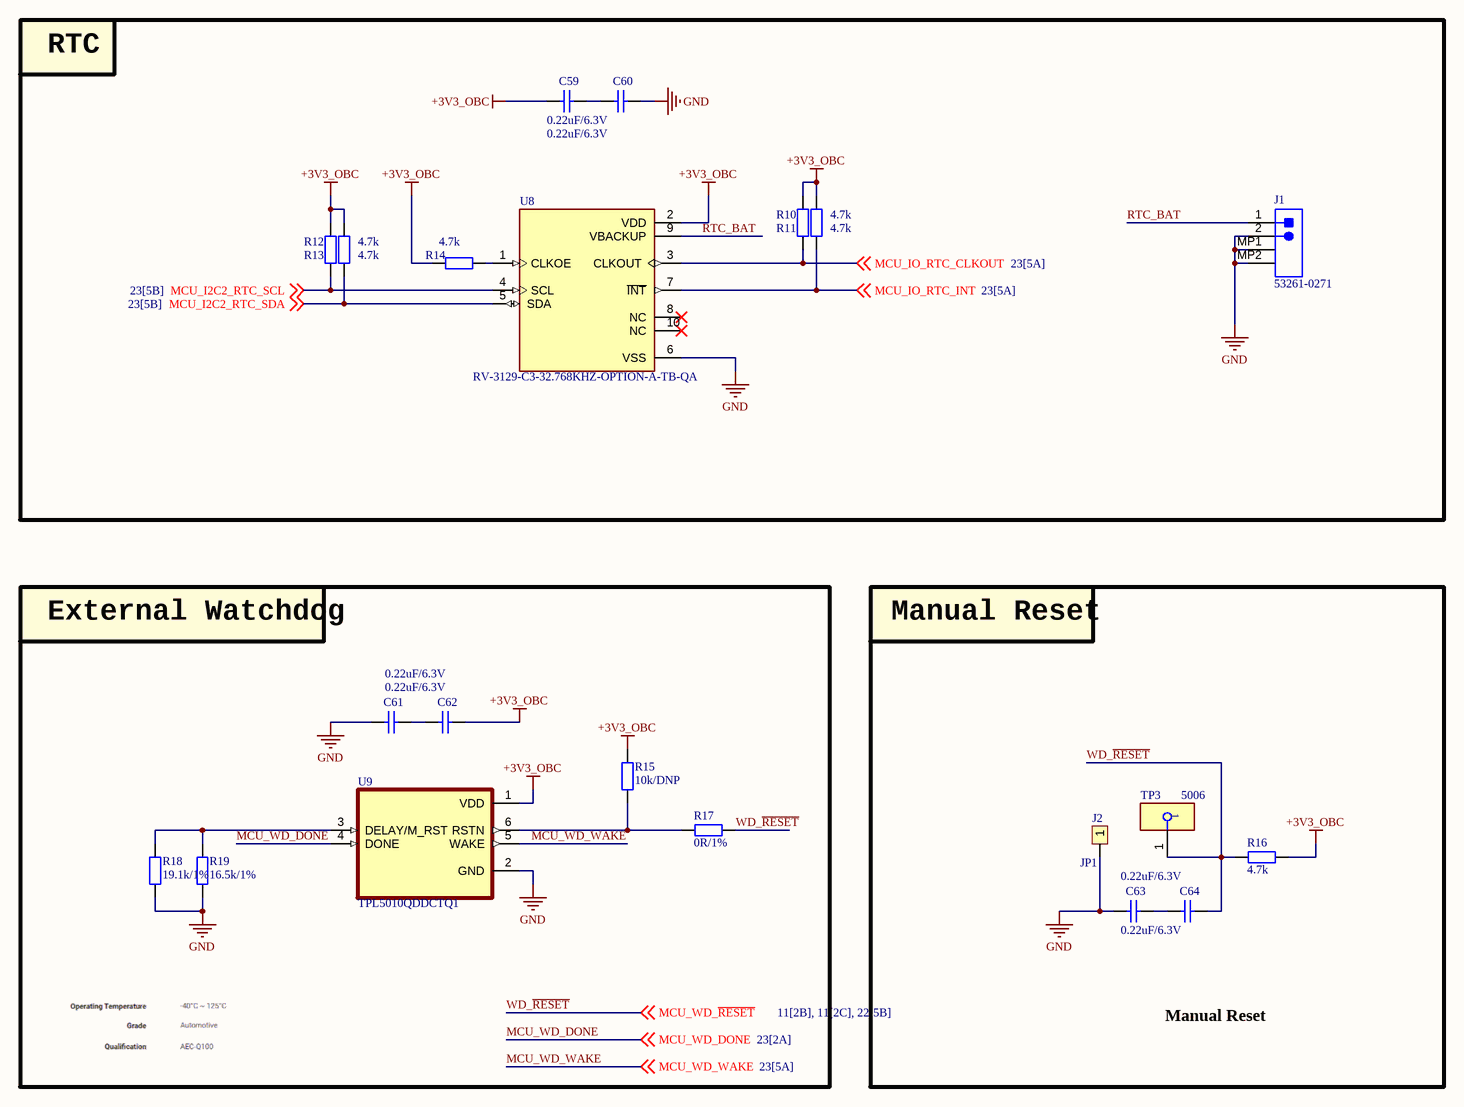
[diagram p6: obc-v2_RTC-WDOG.SchDoc]

### Parts
C59  0.22uF/6.3V  [CAP_C_1005X60]
C60  0.22uF/6.3V  [CAP_C_1005X60]
C61  0.22uF/6.3V  [CAP_C_1005X60]
C62  0.22uF/6.3V  [CAP_C_1005X60]
C63  0.22uF/6.3V  [CAP_C_1005X60]
C64  0.22uF/6.3V  [CAP_C_1005X60]
J1  53261-0271  [MOLX-53261-0271_V]
J2  JP1  [JP1-D1T]
R10  4.7k  [RES_C_1608X60]
R11  4.7k  [RES_C_1608X60]
R12  4.7k  [RES_C_1608X60]
R13  4.7k  [RES_C_1608X60]
R14  4.7k  [RES_C_1608X60]
R15  10k/DNP  [RES_C_1608X60]
R16  4.7k  [RES_C_1608X60]
R17  0R/1%  [RES_C_1608X60]
R18  19.1k/1%  [RES_C_1608X60]
R19  16.5k/1%  [RES_C_1608X60]
TP3  5006  [FP-5006-MFG]
U8  RV-3129-C3-32.768KHZ-OPTION-A-TB-QA  [IC_RV-3129-C3_32.768KHZ_OPTION_A_TB_QA]
U9  TPL5010QDDCTQ1  [SOT95P280X110-6N]

### Blocks framed on the sheet
RTC: C59 C60 J1 R10-R14 U8
External Watchdog: C61 C62 R15 R17-R19 U9
Manual Reset: C63 C64 J2 R16 TP3

### Nets
+3V3_OBC: C59.2 C62.1 R10.2 R11.2 R12.2 R13.2 R14.2 R15.2 R16.2 U8.2(VDD) U9.1(VDD)
GND: C60.1 C61.2 C63.2 J1.2 J1.MP1 J1.MP2 J2.1 R18.1 R19.1 U8.6(VSS) U9.2(GND)
MCU_I2C2_RTC_SCL: R13.1 U8.4(SCL) ; off-sheet MCU_I2C2_RTC_SCL
MCU_I2C2_RTC_SDA: R12.1 U8.5(SDA) ; off-sheet MCU_I2C2_RTC_SDA
MCU_IO_RTC_CLKOUT: R11.1 U8.3(CLKOUT) ; off-sheet MCU_IO_RTC_CLKOUT
MCU_IO_RTC_INT: R10.1 U8.7(~{INT}) ; off-sheet MCU_IO_RTC_INT
MCU_WD_DONE: U9.4(DONE) ; off-sheet MCU_WD_DONE
MCU_WD_~{RESET}: C64.1 R16.1 R17.1 TP3.1 ; off-sheet MCU_WD_~{RESET}  [also labelled WD_~{RESET}]  [project net MCU_~{RST}]
MCU_WD_WAKE: U9.5(WAKE) ; off-sheet MCU_WD_WAKE
RTC_BAT: J1.1 U8.9(VBACKUP)
NetC59_1: C59.1 C60.2
NetC61_1: C61.1 C62.2
NetC63_1: C63.1 C64.2
NetR14_1: R14.1 U8.1(CLKOE)
NetR15_1: R15.1 R17.2 U9.6(RSTN)
NetR18_2: R18.2 R19.2 U9.3(DELAY/M_RST)

Not connected (* = marked no-connect by the designer): U8 8(NC)* 10(NC)*

### Notes on the sheet
- Manual Reset
- Project:
- Sub-system:
- Design by:
- Sheet title:
- Sheet
- A3
- of
- Checked by:
- Approved by:
- Revision:
- Document No:
- Size:
- Date:

### Library data of the parts
C59-C64 = Tu 0402 33nF 10V: as C1 on sheet obc-v2_POWER; Kieu_Chan: *
J1 = CMP-2000-05633-1: PicoBlade(TM) Header, Right Angle, -40 to 85 degC, 2-Pin SMD, RoHS, Tape and Reel; Current - Max: 1A; Brand: Molex; Voltage Rating: 125V; Number of Positions: 2; Pitch: 1.25mm; Package Version: Rev. H, 11/2014; Factory Pack Quantity: 1000; Datasheet URL: http://www.molex.com/webdocs/datasheets/pdf/en-us/0532610271_PCB_HEADERS.pdf; Datasheet Version: 03/2016; Housing Material: Thermoplastic; RoHS: Details; Product Type: Headers; Number of Rows: 1; Termination Style: SMD; Mounting Technology: SurfaceMount; Number of Positions / Contacts: 2; Package URL: http://www.molex.com/pdm_docs/sd/532610271_sd.pdf; Mounting Angle: Right; Mounting Style: SMD/SMT; Manufacturer: Molex; Product Category: 1.25mmConnectors; Tradename: PicoBlade; Voltage - Max: 125V; Manufacturer URL: http://www.molex.com/; Series: 53261; Package Description: 2-Leads Header, Pitch 1.25 mm, Mated Height 3.4 mm; Package Reference: 53261-0271; Current Rating: 1A; Contact Plating: Tin; Contact Material: PhosphorBronze; Type: Shrouded; Packaging: Reel
J2 = JP1: WR-PHD 2.54 mm Angled Socket Header; Manufacturer: W¨¹rth Elektronik eiSos GmbH; partNo: 613002143121; ComponentLink1 Description: Manufacturer; ComponentLink2 Description: Datasheet; NoPins: 02; Created Date: 29 March 2013; ComponentLink1URL: http://www.we-online.com; ComponentLink2URL: http://katalog.we-online.de/em/datasheet/6130xx143121.pdf; Created by: Karrer Zheng
R10-R14 R16 R17 = Tro 0603 1% 10k: as R1 on sheet obc-v2_POWER; Kieu_Chan: *
R15 = Tro 0603 1% 10k: RES SMD 10K OHM 1% 1/10W 0603, P/N: ERJ-3EKF1002V; Chung_Loai: Dán; Don_Vi: Con; So_Chan: 2; Ten_Linh_Kien: Trở 0603 1% 10k; Ma_Hang: MH006333; Kieu_Chan: *
R18 = Tro 0603 1% 10k: RES SMD 19.1K OHM 1% 1/10W 0603, P/N: ERJ-3EKF1912V; Chung_Loai: Dán; Don_Vi: Con; So_Chan: 2; Ten_Linh_Kien: Trở 0603 1% 10k; Ma_Hang: MH006333; Kieu_Chan: *
R19 = Tro 0603 1% 10k: RES SMD 16.5K OHM 1% 1/10W 0603, P/N: ERJ-3EKF1652V; Chung_Loai: Dán; Don_Vi: Con; So_Chan: 2; Ten_Linh_Kien: Trở 0603 1% 10k; Ma_Hang: MH006333; Kieu_Chan: *
TP3 = CMP-19636-000022-1: PC TEST POINT COMPACT BLACK; Body Material: Bronze; Inside Diameter: 1.78mm; Number of Ports: 1; Hole Diameter: 1.6mm; Outside Diameter: 3.18mm; Plating: Silver; Contact Plating: Tin; Color: Black; RoHS Compliant: Yes; Flammability Rating: UL94 V-0; Contact Material: Bronze; Material: Nylon; Orientation: Straight; Package Quantity: 100; Housing Color: Black; Length: 8.89mm; Series: THM; Mount: PCB; Height: 0.35inch; Packaging: Bulk; REACH SVHC: No SVHC; Insulation Material: Nylon; Lead Free: Lead Free
U8 = RV-3129-C3_32.768KHZ_OPTION_A_TB_QA: Real-Time Clock Module, Temperature compensated, in 2.5 x 3.7 mm package; MF: Micro Crystal; MP: RV-3129-C3 32.768KHZ OPTION A TB QA; SnapEDA_Link: https://www.snapeda.com/parts/RV-3129-C3%2032.768KHZ%20OPTION%20A%20TB%20QA/Micro+Crystal/view-part/?ref=snap; Package: QFN-10 Micro Crystal; Value: *; Check_prices: https://www.snapeda.com/parts/RV-3129-C3%2032.768KHZ%20OPTION%20A%20TB%20QA/Micro+Crystal/view-part/?ref=eda
U9 = TPL5010QDDCTQ1: Package: None; Price: None; Value: *; MP: TPL5010QDDCTQ1; Availability: Unavailable

## Sheet obc-v2_FRAM-FLASH.SchDoc
size 420 x 297 mm; SheetNumber: 8; SheetTotal: 23
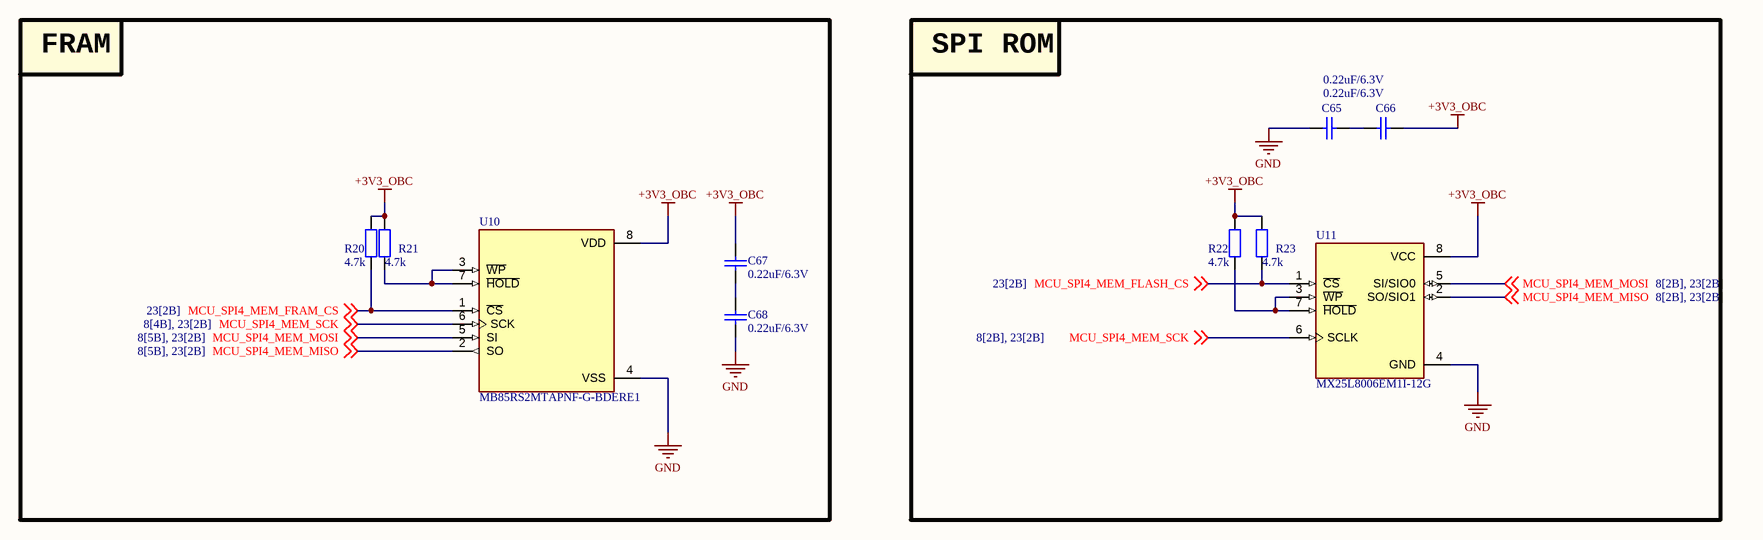
[diagram p7: obc-v2_FRAM-FLASH.SchDoc]

### Parts
C65  0.22uF/6.3V  [CAP_C_1005X60]
C66  0.22uF/6.3V  [CAP_C_1005X60]
C67  0.22uF/6.3V  [CAP_C_1005X60]
C68  0.22uF/6.3V  [CAP_C_1005X60]
R20  4.7k  [RES_C_1608X60]
R21  4.7k  [RES_C_1608X60]
R22  4.7k  [RES_C_1608X60]
R23  4.7k  [RES_C_1608X60]
U10  MB85RS2MTAPNF-G-BDERE1  [SOIC127P602X173-8N]
U11  MX25L8006EM1I-12G  [SOIC127P602X173-8N]

### Blocks framed on the sheet
FRAM: C67 C68 R20 R21 U10
SPI ROM: C65 C66 R22 R23 U11

### Nets
+3V3_OBC: C66.1 C67.1 R20.2 R21.2 R22.2 R23.2 U10.8(VDD) U11.8(VCC)
GND: C65.2 C68.1 U10.4(VSS) U11.4(GND)
MCU_SPI4_MEM_FLASH_CS: R23.1 U11.1(~{CS}) ; off-sheet MCU_SPI4_MEM_FLASH_CS
MCU_SPI4_MEM_FRAM_CS: R20.1 U10.1(~{CS}) ; off-sheet MCU_SPI4_MEM_FRAM_CS
MCU_SPI4_MEM_MISO: U10.2(SO) U11.2(SO/SIO1) ; off-sheet MCU_SPI4_MEM_MISO
MCU_SPI4_MEM_MOSI: U10.5(SI) U11.5(SI/SIO0) ; off-sheet MCU_SPI4_MEM_MOSI
MCU_SPI4_MEM_SCK: U10.6(SCK) U11.6(SCLK) ; off-sheet MCU_SPI4_MEM_SCK
NetC65_1: C65.1 C66.2
NetC67_2: C67.2 C68.2
NetR21_1: R21.1 U10.3(~{WP}) U10.7(~{HOLD})
NetR22_1: R22.1 U11.3(~{WP}) U11.7(~{HOLD})

### Notes on the sheet
- Project:
- Sub-system:
- Design by:
- Sheet title:
- Sheet
- A3
- of
- Checked by:
- Approved by:
- Revision:
- Document No:
- Size:
- Date:

### Library data of the parts
C65-C68 = Tu 0402 33nF 10V: as C1 on sheet obc-v2_POWER; Kieu_Chan: *
R20-R23 = Tro 0603 1% 10k: as R1 on sheet obc-v2_POWER; Kieu_Chan: *
U10 = MB85RS2MTAPNF-G-BDERE1: FRAM _Ferroelectric RAM_ Memory IC 2Mb _256K x 8_ SPI 40MHz 8-SOP; MF: Fujitsu Electronics; Package: SO-8 Fujitsu; Value: *; Digi-Key_Purchase_URL: https://www.digikey.com/product-detail/en/fujitsu-electronics-america-inc/MB85RS2MTAPNF-G-BDERE1/865-1286-1-ND/7916252?utm_source=snapeda&utm_medium=aggregator&utm_campaign=symbol; Digi-Key_Part_Number: 865-1286-1-ND; SnapEDA_Link: https://www.snapeda.com/parts/MB85RS2MTAPNF-G-BDERE1/Fujitsu%20Electronics%20America%2C%20Inc./view-part/2344795/?ref=snap; MP: MB85RS2MTAPNF-G-BDERE1
U11 = MX25L8006EM1I-12G: FLASH - NOR Memory IC 8Mb (1M x 8) SPI 86 MHz 8-SOP; MF: Macronix; SnapEDA_Link: https://www.snapeda.com/parts/MX25L8006EM1I-12G/Macronix/view-part/?ref=snap; Package: SOP-8 Macronix; Value: *; MP: MX25L8006EM1I-12G; Check_prices: https://www.snapeda.com/parts/MX25L8006EM1I-12G/Macronix/view-part/?ref=eda

## Sheet obc-v2_BOARD-CONNECT.SchDoc
size 420 x 297 mm; SheetNumber: 8; SheetTotal: 21
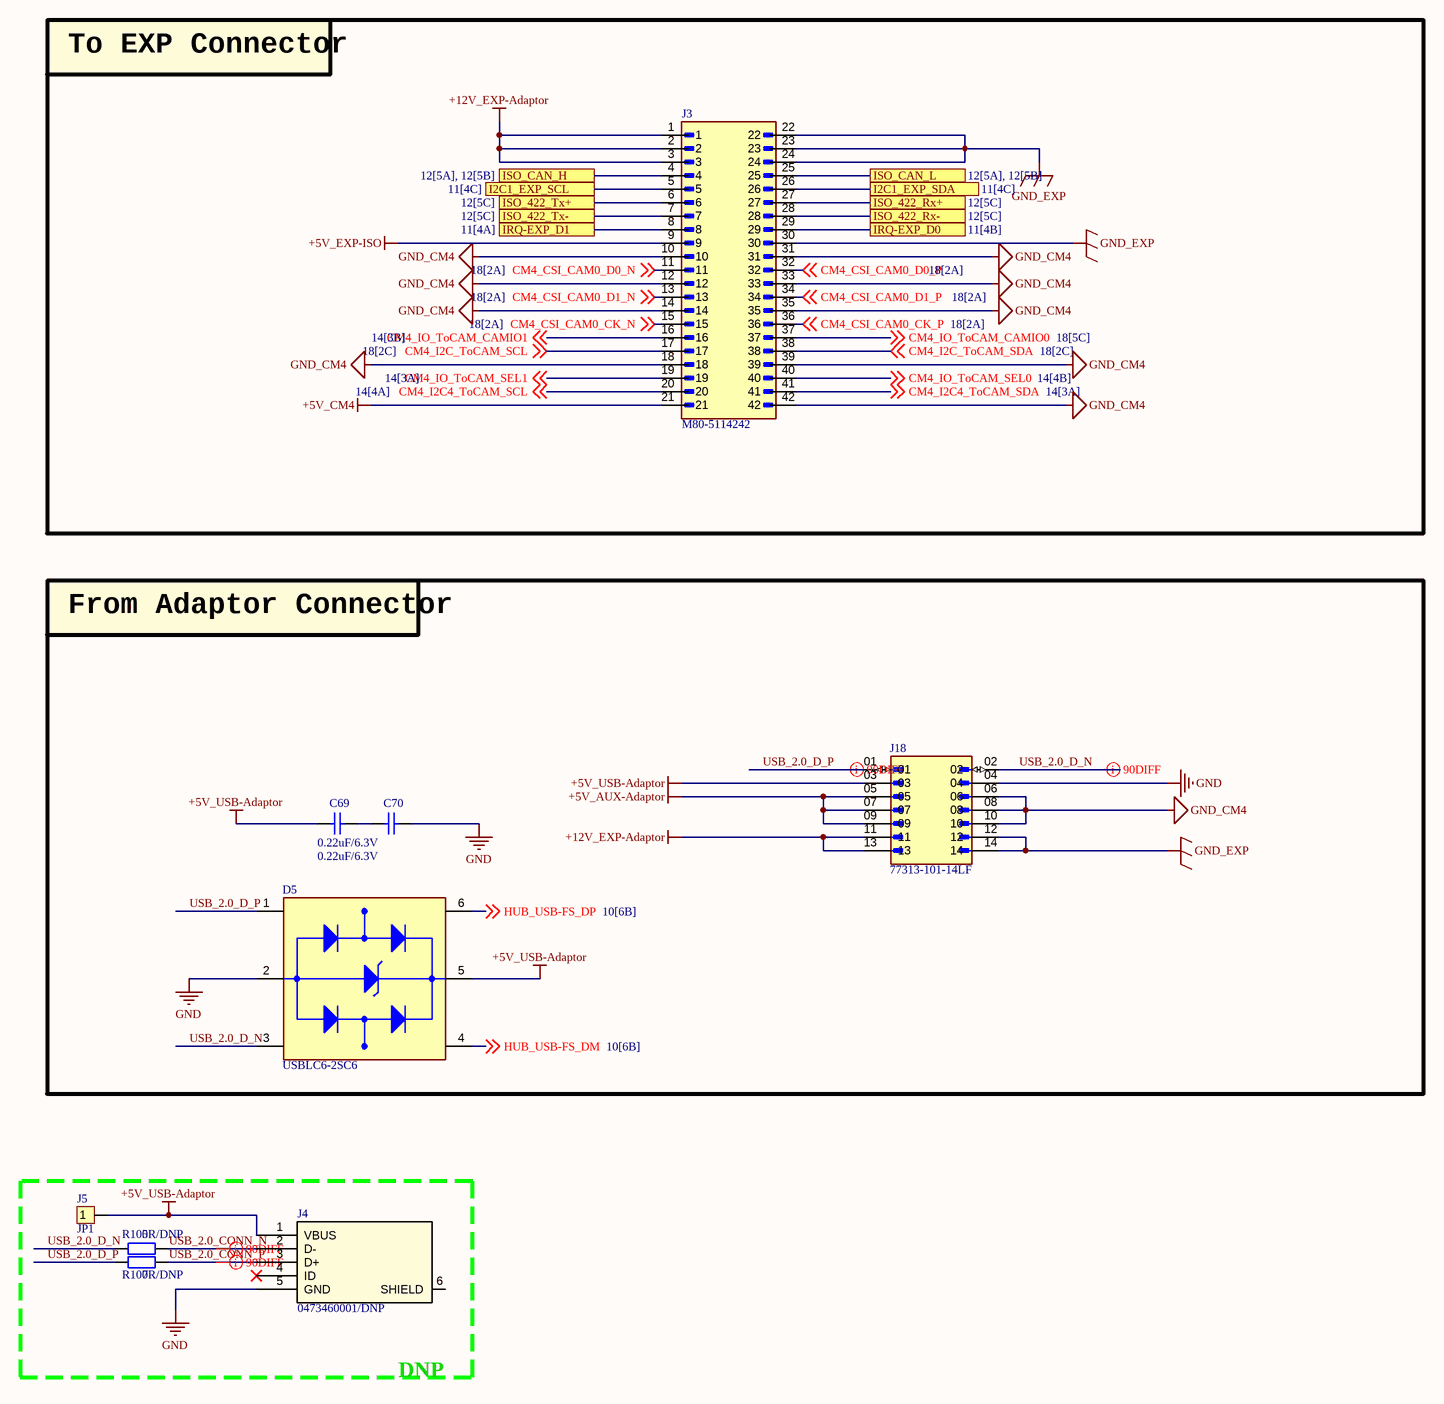
[diagram p8: obc-v2_BOARD-CONNECT.SchDoc]

### Parts
C69  0.22uF/6.3V  [CAP_C_1005X60]
C70  0.22uF/6.3V  [CAP_C_1005X60]
D5  USBLC6-2SC6  [SOT95P280X145-6N]
J3  M80-5114242  [HARWIN_M80-5114242]
J4  0473460001/DNP  [47346-0001_MOL]
J5  JP1  [JP1-D1T]
J18  77313-101-14LF  [AMPHENOL_77313-101-14LF]
R105  0R/DNP  [RES_C_1608X60]
R107  0R/DNP  [RES_C_1608X60]

### Blocks framed on the sheet
To EXP Connector: J3
From Adaptor Connector: C69 C70 D5 J18

### Ports
I2C1_EXP_SCL (see 11[4C]), I2C1_EXP_SDA (see 11[4C]), IRQ-EXP_D0 (see 11[4B]), IRQ-EXP_D1 (see 11[4A]), ISO_422_Rx+ (see 12[5C]), ISO_422_Rx- (see 12[5C]), ISO_422_Tx+ (see 12[5C]), ISO_422_Tx- (see 12[5C]), ISO_CAN_H (see 12[5A], 12[5B]), ISO_CAN_L (see 12[5A], 12[5B])

### Nets
+5V_AUX-Adaptor: J3.21 J18.05 J18.07 J18.09  [also labelled +5V_CM4]
+5V_EXP-ISO: J3.9
+5V_USB-Adaptor: C69.2 D5.5(VBUS) J4.1(VBUS) J5.1 J18.03
+12V_EXP-Adaptor: J3.1 J3.2 J3.3 J18.11 J18.13
GND: C70.1 D5.2(GND) J4.5(GND) J18.04
GND_CM4: J3.10 J3.12 J3.14 J3.18 J3.31 J3.33 J3.35 J3.39 J3.42 J18.06 J18.08 J18.10
GND_EXP: J3.22 J3.23 J3.24 J3.30 J18.12 J18.14
CM4_CSI_CAM0_CK_N: J3.15 ; off-sheet CM4_CSI_CAM0_CK_N  [project net CAM0_CK_N]
CM4_CSI_CAM0_CK_P: J3.36 ; off-sheet CM4_CSI_CAM0_CK_P  [project net CAM0_CK_P]
CM4_CSI_CAM0_D0_N: J3.11 ; off-sheet CM4_CSI_CAM0_D0_N  [project net CAM0_D0_N]
CM4_CSI_CAM0_D0_P: J3.32 ; off-sheet CM4_CSI_CAM0_D0_P  [project net CAM0_D0_P]
CM4_CSI_CAM0_D1_N: J3.13 ; off-sheet CM4_CSI_CAM0_D1_N  [project net CAM0_D1_N]
CM4_CSI_CAM0_D1_P: J3.34 ; off-sheet CM4_CSI_CAM0_D1_P  [project net CAM0_D1_P]
CM4_I2C4_ToCAM_SCL: J3.20 ; off-sheet CM4_I2C4_ToCAM_SCL
CM4_I2C4_ToCAM_SDA: J3.41 ; off-sheet CM4_I2C4_ToCAM_SDA
CM4_I2C_ToCAM_SCL: J3.17 ; off-sheet CM4_I2C_ToCAM_SCL
CM4_I2C_ToCAM_SDA: J3.38 ; off-sheet CM4_I2C_ToCAM_SDA
CM4_IO_ToCAM_CAMIO0: J3.37 ; off-sheet CM4_IO_ToCAM_CAMIO0
CM4_IO_ToCAM_CAMIO1: J3.16 ; off-sheet CM4_IO_ToCAM_CAMIO1
CM4_IO_ToCAM_SEL0: J3.40 ; off-sheet CM4_IO_ToCAM_SEL0
CM4_IO_ToCAM_SEL1: J3.19 ; off-sheet CM4_IO_ToCAM_SEL1
HUB_USB-FS_DM: D5.4(I/O2_OUT) ; off-sheet HUB_USB-FS_DM  [project net HUB_USB-FS_D_N]
HUB_USB-FS_DP: D5.6(I/O1_OUT) ; off-sheet HUB_USB-FS_DP  [project net HUB_USB-FS_D_P]
Rx+: J3.27 ; port ISO_422_Rx+
Rx-: J3.28 ; port ISO_422_Rx-
Tx+: J3.6 ; port ISO_422_Tx+
Tx-: J3.7 ; port ISO_422_Tx-
USB_2.0_CONN_N: J4.2(D-) R105.1
USB_2.0_CONN_P: J4.3(D+) R107.1
USB_2.0_D_N: D5.3(I/O2_IN) J18.02 R105.2
USB_2.0_D_P: D5.1(I/O1_IN) J18.01 R107.2
NetC69_1: C69.1 C70.2
NetJ3_4: J3.4 ; port ISO_CAN_H
NetJ3_5: J3.5 ; port I2C1_EXP_SCL
NetJ3_8: J3.8 ; port IRQ-EXP_D1
NetJ3_25: J3.25 ; port ISO_CAN_L
NetJ3_26: J3.26 ; port I2C1_EXP_SDA
NetJ3_29: J3.29 ; port IRQ-EXP_D0

Not connected (* = marked no-connect by the designer): J4 4(ID)* 6(SHIELD)

### Layout directives
differential pair; differential pair class DIFF90: USB_2.0_CONN_N, USB_2.0_CONN_P, USB_2.0_D_N, USB_2.0_D_P

### Notes on the sheet
- DNP
- Project:
- Sub-system:
- Design by:
- Sheet title:
- Sheet
- A3
- of
- Checked by:
- Approved by:
- Revision:
- Document No:
- Size:
- Date:

### Library data of the parts
C69 C70 = Tu 0402 33nF 10V: as C1 on sheet obc-v2_POWER; Kieu_Chan: *
D5 = USBLC6-2SC6: 17V Clamp 5A (8/20Âµs) Ipp Tvs Diode Surface Mount SOT-23-6; MF: STMicroelectronics; Value: *; SnapEDA_Link: https://www.snapeda.com/parts/USBLC6-2SC6/STMicroelectronics/view-part/?ref=snap; Check_prices: https://www.snapeda.com/parts/USBLC6-2SC6/STMicroelectronics/view-part/?ref=eda; Purchase-URL: https://pricing.snapeda.com/search/part/USBLC6-2SC6/?ref=eda; Price: None; Availability: In Stock; Package: SOT-23-6 STMicroelectronics; MP: USBLC6-2SC6
J4 = USB_micro: No Description Available; Mfr_Name: Molex Connector Corporation; RefDes: RefDes; Type: Type
J5 = JP1: as J2 on sheet obc-v2_RTC-WDOG; Created Date: 29 March 2013; ComponentLink1URL: http://www.we-online.com; ComponentLink2URL: http://katalog.we-online.de/em/datasheet/6130xx143121.pdf; Created by: Karrer Zheng
J18 = 77313-101-14LF: MF: AMPHENOL ICC / FCI; Package: None; Price: None; Value: *; MP: 77313-101-14LF; Availability: Unavailable
R105 R107 = Tro 0603 1% 1k: RES SMD 12K OHM 1% 1/10W 0603, P/N: ERJ-3EKF1202V; Chung_Loai: Dán; So_Chan: 2; Don_Vi: Con; Ten_Linh_Kien: Trở 0603 1% 1k; Ma_Hang: MH006334; Kieu_Chan: *
J3 = M80-5114242: Package: None; Price: None; Value: *; MP: M80-5114242; Availability: Unavailable

## Sheet obc-v2_DEBUG.SchDoc
size 420 x 297 mm; SheetNumber: 9; SheetTotal: 21
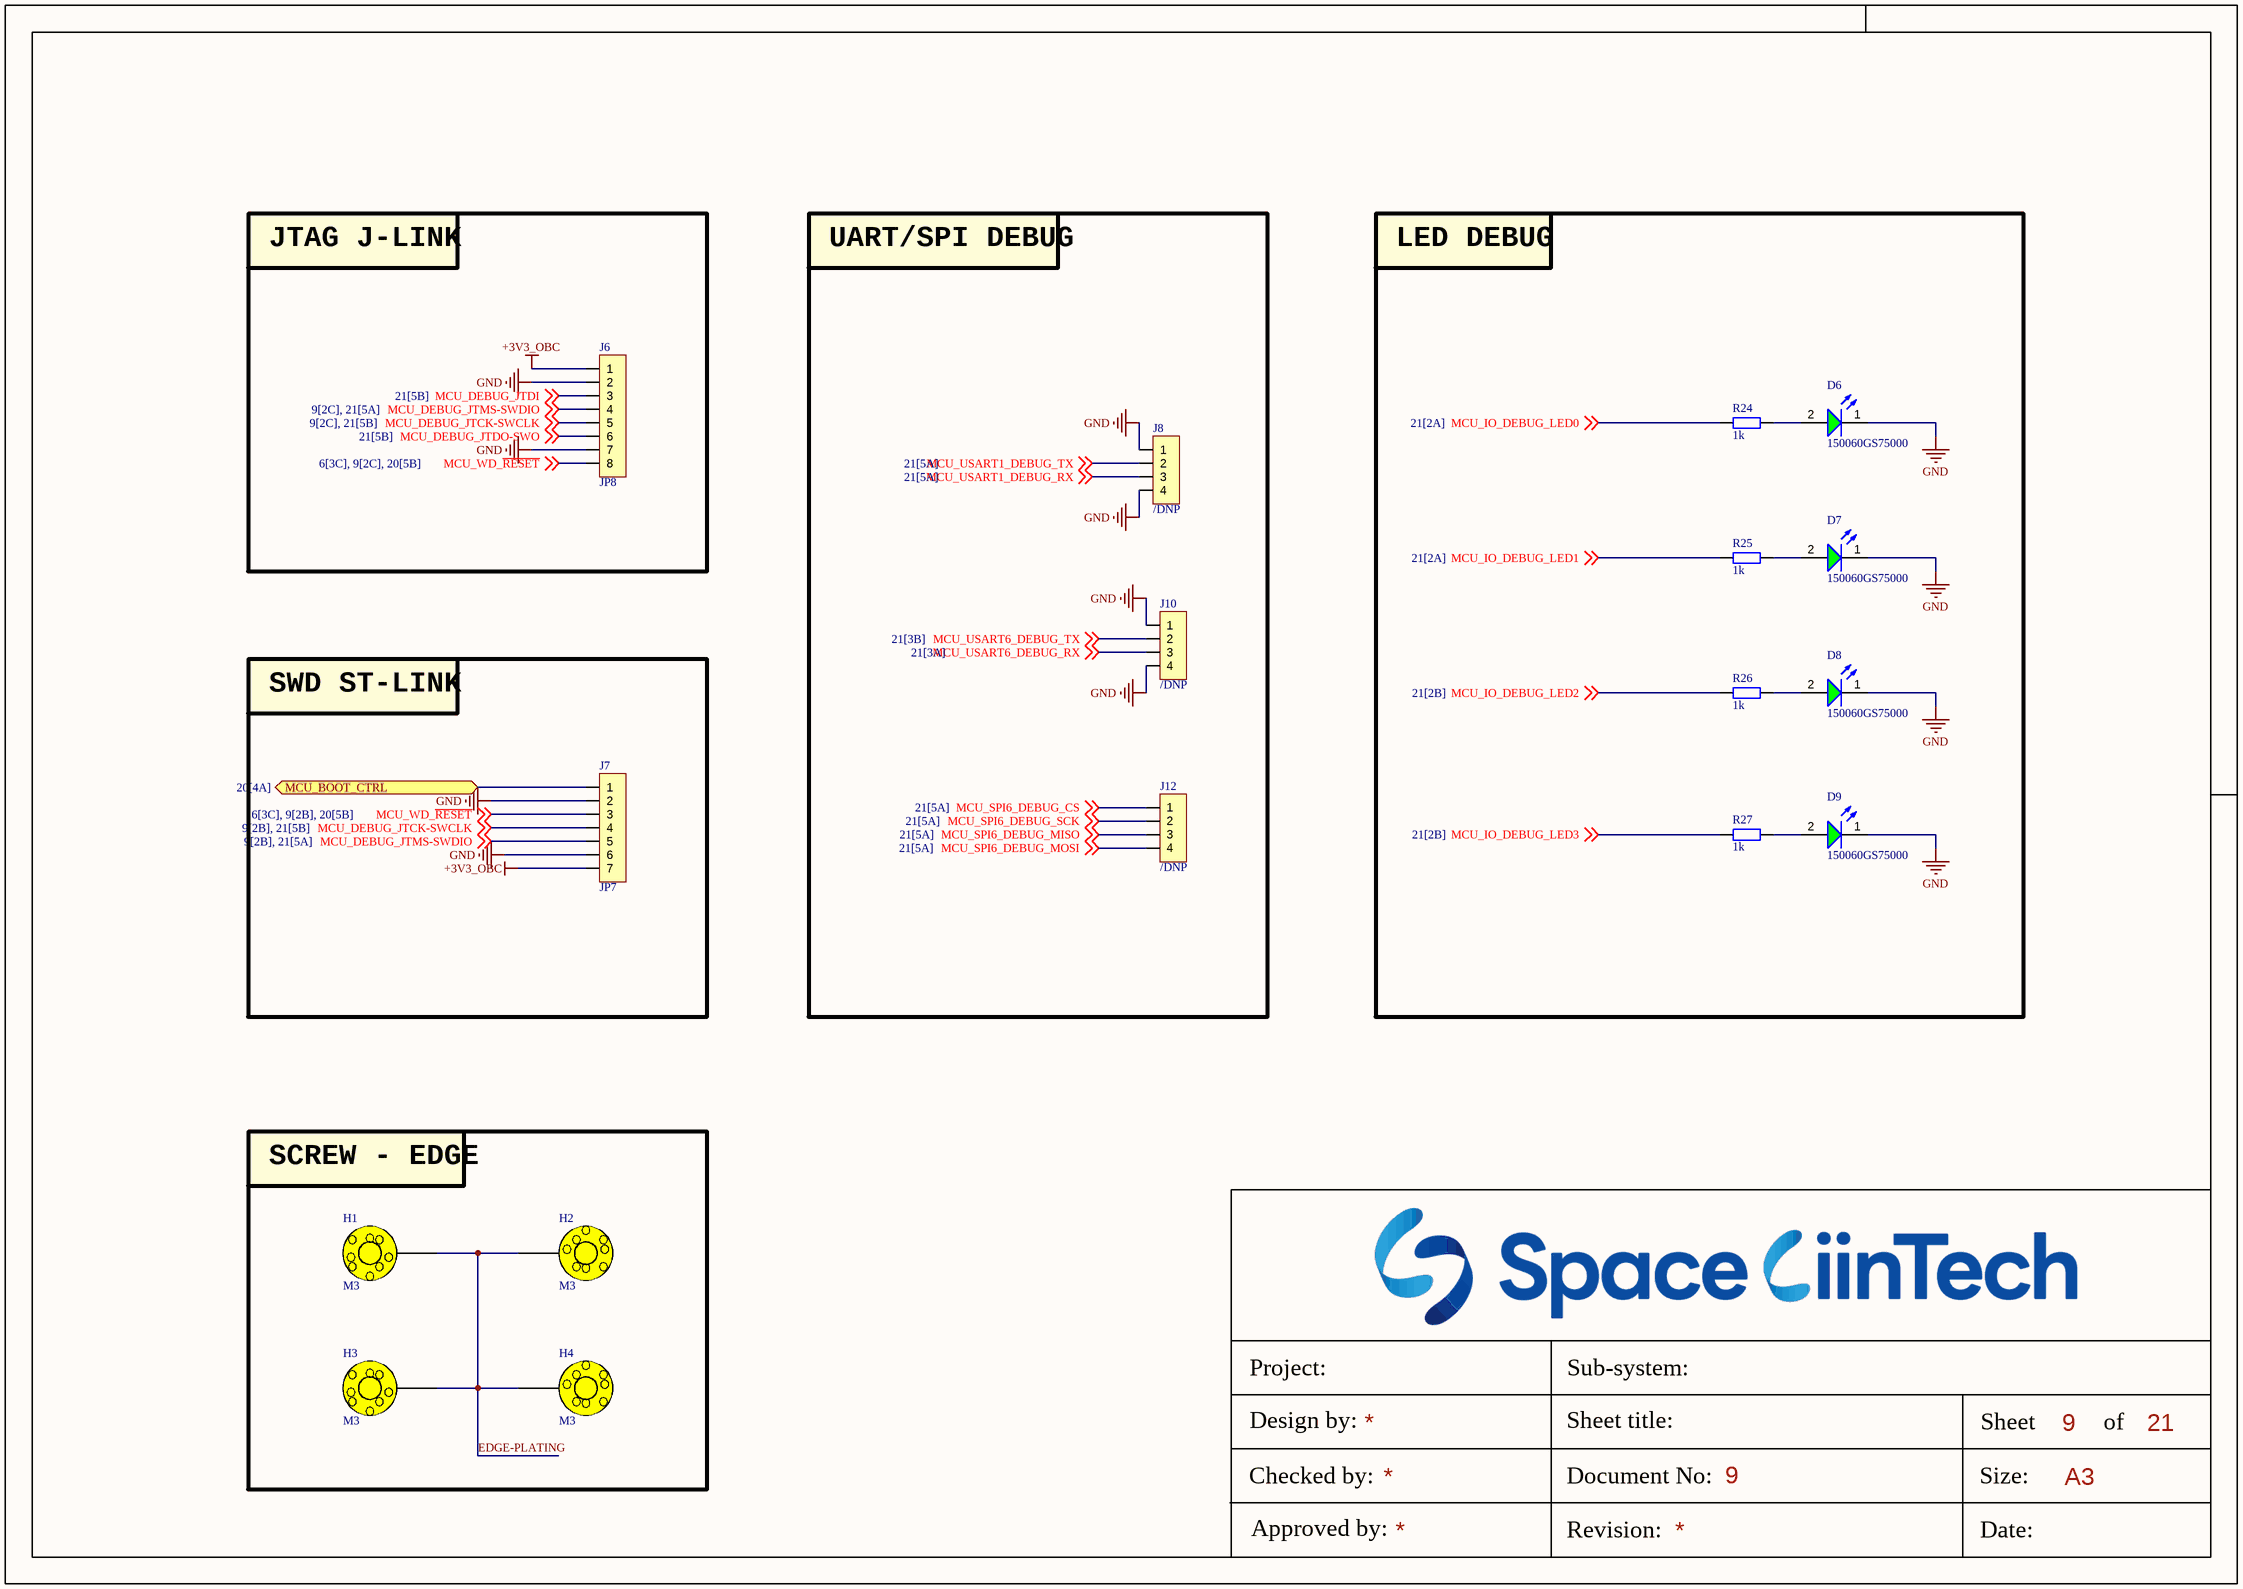
[diagram p9: obc-v2_DEBUG.SchDoc]

### Parts
D6  150060GS75000  [WL-SMCW_0603_150060xx75000]
D7  150060GS75000  [WL-SMCW_0603_150060xx75000]
D8  150060GS75000  [WL-SMCW_0603_150060xx75000]
D9  150060GS75000  [WL-SMCW_0603_150060xx75000]
H1  M3  [HEX-M3]
H2  M3  [HEX-M3]
H3  M3  [HEX-M3]
H4  M3  [HEX-M3]
J6  JP8  [JP8-C1T]
J7  JP7  [JP7-C1T]
J8  /DNP  [JP4-C1T]
J10  /DNP  [JP4-C1T]
J12  /DNP  [JP4-C1T]
R24  1k  [RES_C_1608X60]
R25  1k  [RES_C_1608X60]
R26  1k  [RES_C_1608X60]
R27  1k  [RES_C_1608X60]

### Blocks framed on the sheet
JTAG J-LINK: J6
UART/SPI DEBUG: J8 J10 J12
LED DEBUG: D6-D9 R24-R27
SWD ST-LINK: J7
SCREW - EDGE: H1-H4

### Ports
MCU_BOOT_CTRL (bidir, see 20[4A])

### Nets
+3V3_OBC: J6.1 J7.7
GND: D6.1(K) D7.1(K) D8.1(K) D9.1(K) J6.2 J6.7 J7.2 J7.6 J8.1 J8.4 J10.1 J10.4
EDGE-PLATING: H1.1 H2.1 H3.1 H4.1
MCU_BOOT0: J7.1 ; port MCU_BOOT_CTRL
MCU_DEBUG_JTCK-SWCLK: J6.5 J7.4 ; off-sheet MCU_DEBUG_JTCK-SWCLK
MCU_DEBUG_JTDI: J6.3 ; off-sheet MCU_DEBUG_JTDI
MCU_DEBUG_JTDO-SWO: J6.6 ; off-sheet MCU_DEBUG_JTDO-SWO
MCU_DEBUG_JTMS-SWDIO: J6.4 J7.5 ; off-sheet MCU_DEBUG_JTMS-SWDIO
MCU_IO_DEBUG_LED0: R24.2 ; off-sheet MCU_IO_DEBUG_LED0
MCU_IO_DEBUG_LED1: R25.2 ; off-sheet MCU_IO_DEBUG_LED1
MCU_IO_DEBUG_LED2: R26.2 ; off-sheet MCU_IO_DEBUG_LED2
MCU_IO_DEBUG_LED3: R27.2 ; off-sheet MCU_IO_DEBUG_LED3
MCU_SPI6_DEBUG_CS: J12.1 ; off-sheet MCU_SPI6_DEBUG_CS
MCU_SPI6_DEBUG_MISO: J12.3 ; off-sheet MCU_SPI6_DEBUG_MISO
MCU_SPI6_DEBUG_MOSI: J12.4 ; off-sheet MCU_SPI6_DEBUG_MOSI
MCU_SPI6_DEBUG_SCK: J12.2 ; off-sheet MCU_SPI6_DEBUG_SCK
MCU_USART1_DEBUG_RX: J8.3 ; off-sheet MCU_USART1_DEBUG_RX
MCU_USART1_DEBUG_TX: J8.2 ; off-sheet MCU_USART1_DEBUG_TX
MCU_USART6_DEBUG_RX: J10.3 ; off-sheet MCU_USART6_DEBUG_RX
MCU_USART6_DEBUG_TX: J10.2 ; off-sheet MCU_USART6_DEBUG_TX
MCU_WD_~{RESET}: J6.8 J7.3 ; off-sheet MCU_WD_~{RESET}  [project net MCU_~{RST}]
NetD6_2: D6.2(A) R24.1
NetD7_2: D7.2(A) R25.1
NetD8_2: D8.2(A) R26.1
NetD9_2: D9.2(A) R27.1

### Notes on the sheet
- Project:
- Sub-system:
- Design by:
- Sheet title:
- Sheet
- A3
- of
- Checked by:
- Approved by:
- Revision:
- Document No:
- Size:
- Date:

### Library data of the parts
D6-D9 = CMP-1426-00002-4: 430mcd Colorless transparence 520nm Emerald 140° LED0603 Light Emitting Diodes (LED) ROHS; Peak Wavelength: 515nm; Forward Current: 100mA; Reverse Voltage: 5V; Output Current: 10µA; Power Dissipation: 105mW; Lens Style: Clear, Rectangular; Dominant Wavelength: 525nm; Color: Green; Test Current: 20mA; Max Junction Temperature (Tj): 95°C; Forward Voltage: 3.2V; Width: 800µm; Max Operating Temperature: 85°C; Case Code (Metric): 1608; Luminous Intensity: 430mcd; Lead Free: Lead Free; Case/Package: 0603; Case Code (Imperial): 0603; Mount: Surface Mount; Max Reverse Voltage (DC): 5V; Packaging: Tape and Reel; RoHS: Compliant; Viewing Angle: 140°; REACH SVHC: Unknown; Min Operating Temperature: -40°C; Height: 700µm; Wavelength: 525nm; Length: 1.6mm
H1-H4 = HEX-M3
J8 J10 J12 = JP4: WR-PHD 2.54 mm Angled Socket Header; Manufacturer: W¨¹rth Elektronik eiSos GmbH; partNo: 613004143121; ComponentLink1 Description: Manufacturer; ComponentLink2 Description: Datasheet; NoPins: 04; Created Date: 29 March 2013; ComponentLink1URL: http://www.we-online.com; ComponentLink2URL: http://katalog.we-online.de/em/datasheet/6130xx143121.pdf; Created by: Karrer Zheng
R24-R27 = Tro 0603 1% 10k: as R1 on sheet obc-v2_POWER; Kieu_Chan: *

## Sheet obc-v2_USB-HUB.SchDoc
size 420 x 297 mm; SheetNumber: 10; SheetTotal: 21
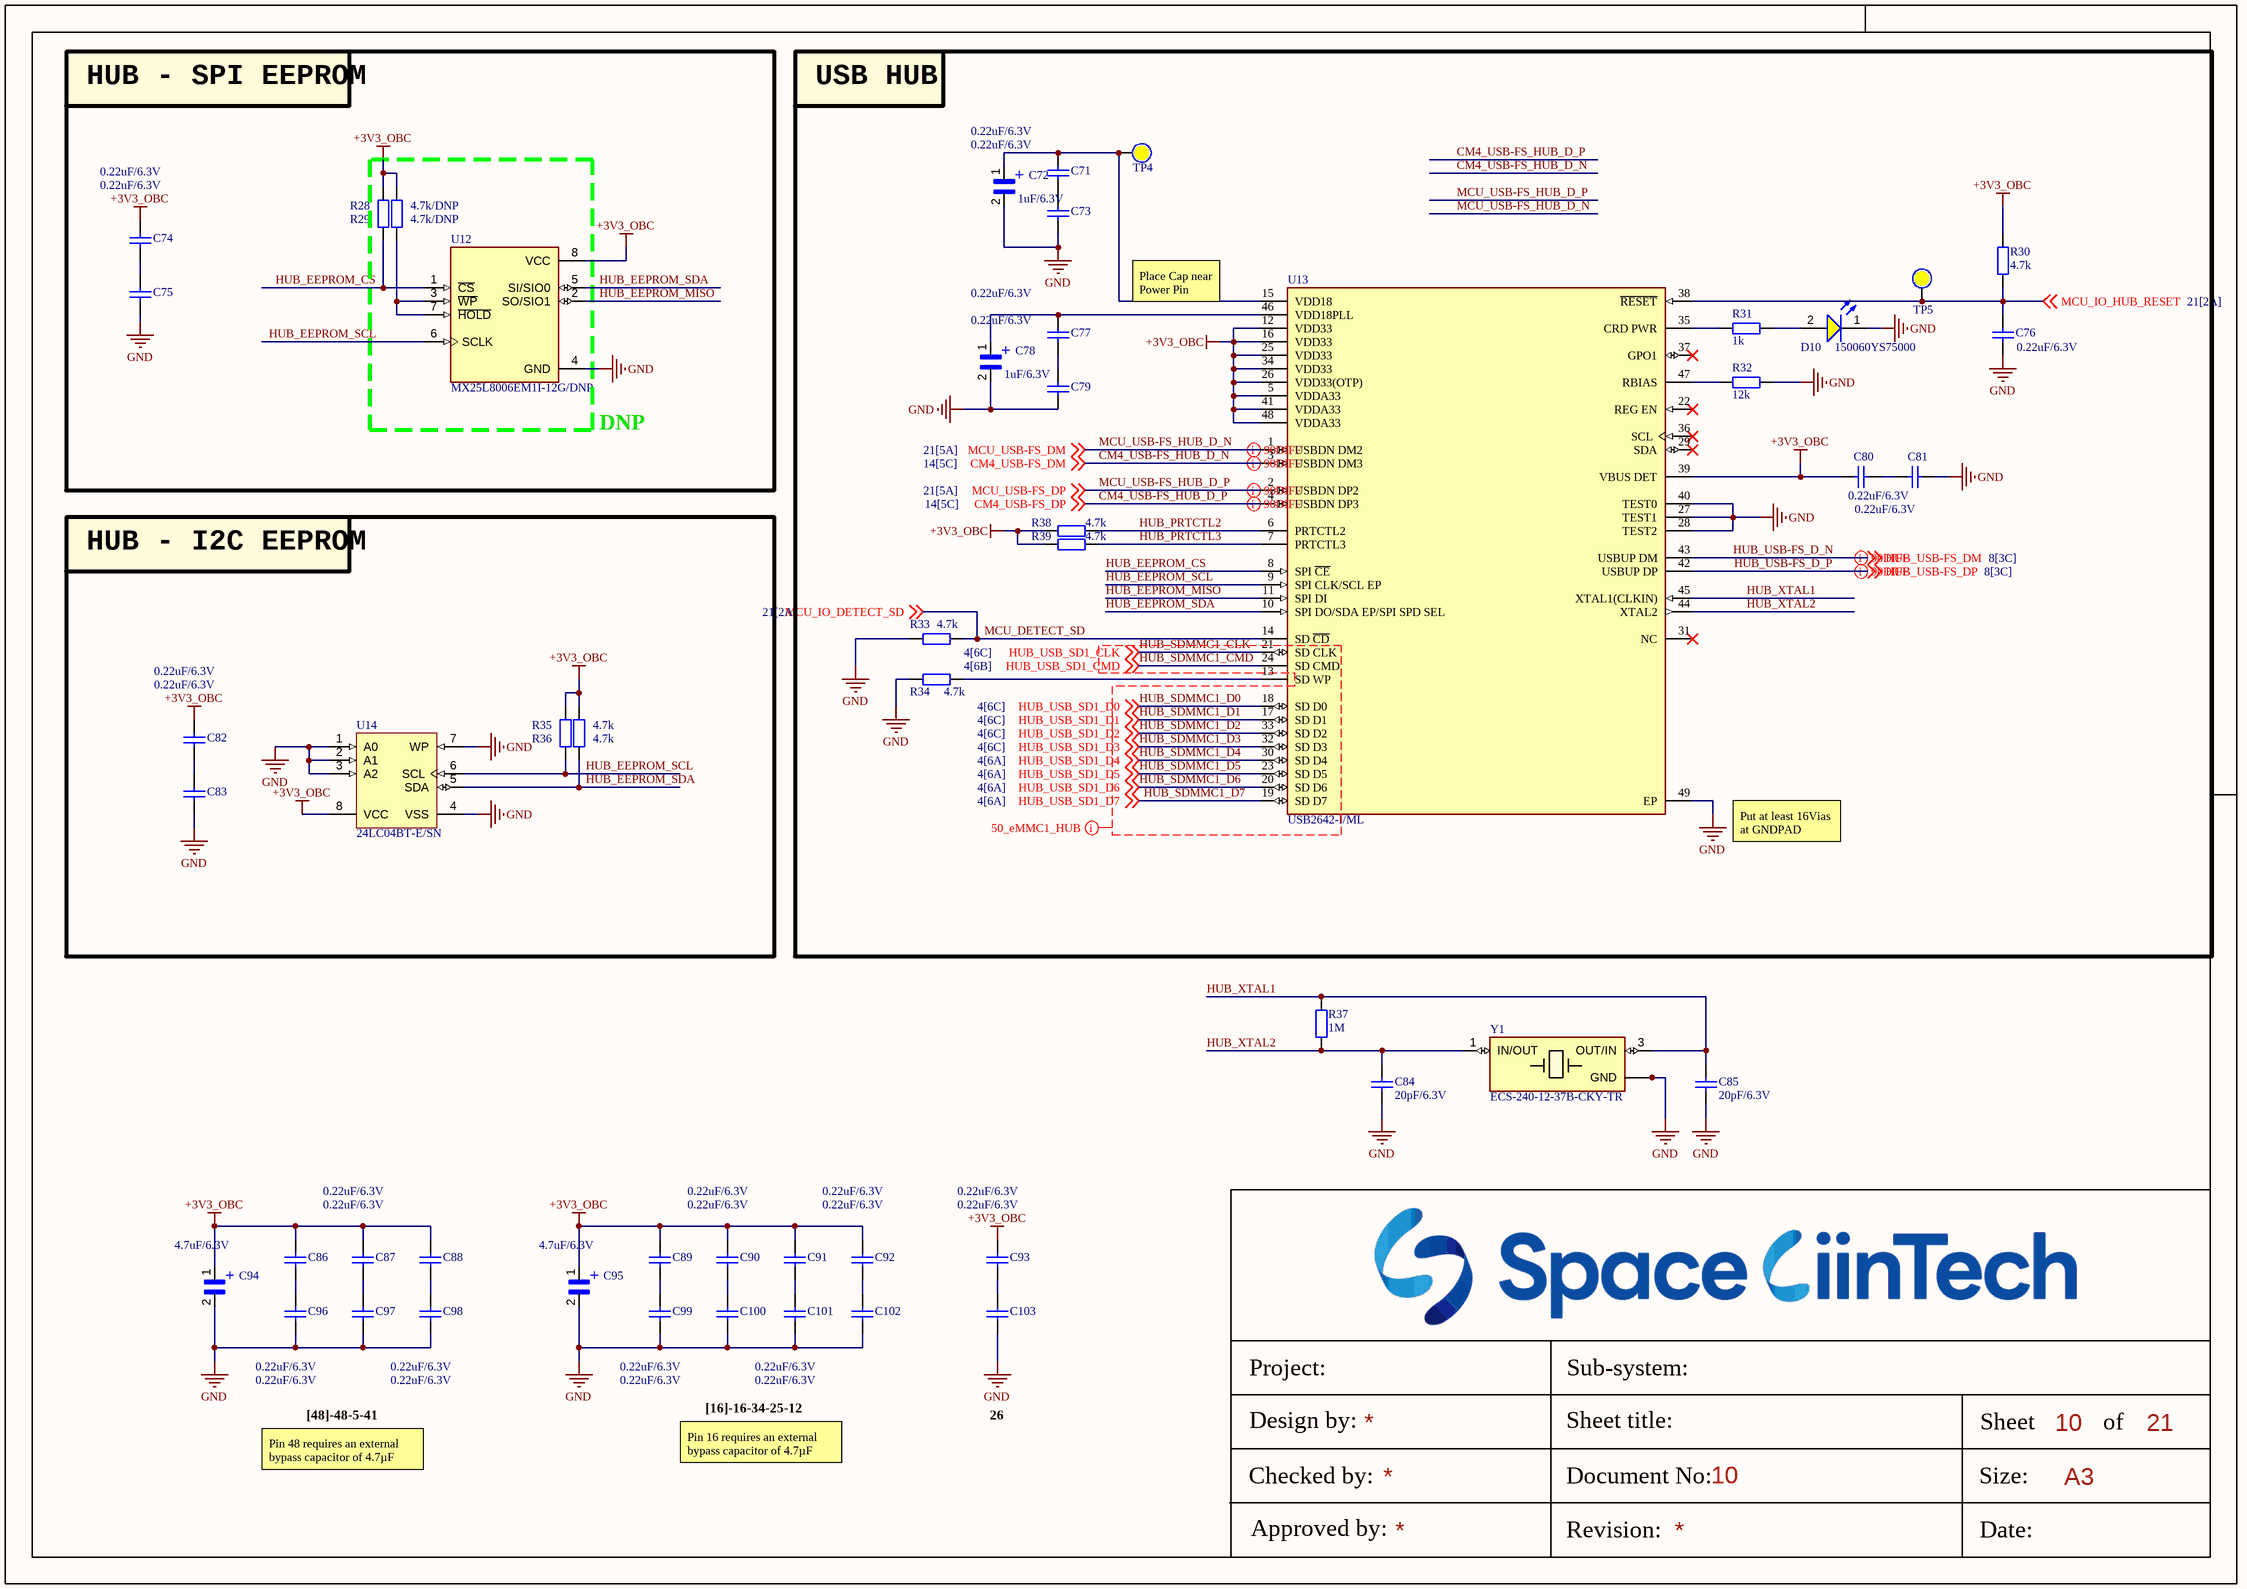
[diagram p10: obc-v2_USB-HUB.SchDoc]

### Parts
C71  0.22uF/6.3V  [CAP_C_1005X60]
C72  1uF/6.3V  [CAP_MP_1608X90]
C73  0.22uF/6.3V  [CAP_C_1005X60]
C74  0.22uF/6.3V  [CAP_C_1005X60]
C75  0.22uF/6.3V  [CAP_C_1005X60]
C76  0.22uF/6.3V  [CAP_C_1005X60]
C77  0.22uF/6.3V  [CAP_C_1005X60]
C78  1uF/6.3V  [CAP_MP_1608X90]
C79  0.22uF/6.3V  [CAP_C_1005X60]
C80  0.22uF/6.3V  [CAP_C_1005X60]
C81  0.22uF/6.3V  [CAP_C_1005X60]
C82  0.22uF/6.3V  [CAP_C_1005X60]
C83  0.22uF/6.3V  [CAP_C_1005X60]
C84  20pF/6.3V  [CAP_C_1005X60]
C85  20pF/6.3V  [CAP_C_1005X60]
C86  0.22uF/6.3V  [CAP_C_1005X60]
C87  0.22uF/6.3V  [CAP_C_1005X60]
C88  0.22uF/6.3V  [CAP_C_1005X60]
C89  0.22uF/6.3V  [CAP_C_1005X60]
C90  0.22uF/6.3V  [CAP_C_1005X60]
C91  0.22uF/6.3V  [CAP_C_1005X60]
C92  0.22uF/6.3V  [CAP_C_1005X60]
C93  0.22uF/6.3V  [CAP_C_1005X60]
C94  4.7uF/6.3V  [CAP_MP_1608X90]
C95  4.7uF/6.3V  [CAP_MP_1608X90]
C96  0.22uF/6.3V  [CAP_C_1005X60]
C97  0.22uF/6.3V  [CAP_C_1005X60]
C98  0.22uF/6.3V  [CAP_C_1005X60]
C99  0.22uF/6.3V  [CAP_C_1005X60]
C100  0.22uF/6.3V  [CAP_C_1005X60]
C101  0.22uF/6.3V  [CAP_C_1005X60]
C102  0.22uF/6.3V  [CAP_C_1005X60]
C103  0.22uF/6.3V  [CAP_C_1005X60]
D10  150060YS75000  [WL-SMCW_0603_150060xx75000]
R28  4.7k/DNP  [RES_C_1608X60]
R29  4.7k/DNP  [RES_C_1608X60]
R30  4.7k  [RES_C_1608X60]
R31  1k  [RES_C_1608X60]
R32  12k  [RES_C_1608X60]
R33  4.7k  [RES_C_1608X60]
R34  4.7k  [RES_C_1608X60]
R35  4.7k  [RES_C_1608X60]
R36  4.7k  [RES_C_1608X60]
R37  1M  [RES_C_1608X60]
R38  4.7k  [RES_C_1608X60]
R39  4.7k  [RES_C_1608X60]
TP4  (no value)  [Test Point 1 Side]  (no BOM)
TP5  (no value)  [Test Point 1 Side]  (no BOM)
U12  MX25L8006EM1I-12G/DNP  [SOIC127P602X173-8N]
U13  USB2642-I/ML  [FP-48QFN-5304-7x7B-IPC_A]
U14  24LC04BT-E/SN  [SOIC-SN8_L]
Y1  ECS-240-12-37B-CKY-TR  [XTAL_ECS-240-12-37B-CKY-TR]

### Blocks framed on the sheet
HUB - SPI EEPROM: C74 C75 R28 R29 U12
USB HUB: C71-C73 C76-C81 D10 R30-R34 R38 R39 TP4 TP5 U13
HUB - I2C EEPROM: C82 C83 R35 R36 U14

### Nets
+3V3_OBC: C74.1 C80.1 C82.1 C86.1 C87.1 C88.1 C89.1 C90.1 C91.1 C92.1 C93.1 C94.1 C95.1 R28.2 R29.2 R30.1 R35.2 R36.2 R38.1 R39.1 U12.8(VCC) U13.5(VDDA33) U13.12(VDD33) U13.16(VDD33) U13.25(VDD33) U13.26(VDD33(OTP)) U13.34(VDD33) U13.39(VBUS_DET) U13.41(VDDA33) U13.48(VDDA33) U14.8(VCC)
GND: C72.2 C73.1 C75.2 C76.2 C78.2 C79.1 C81.2 C83.2 C84.1 C85.1 C94.2 C95.2 C96.2 C97.2 C98.2 C99.2 C100.2 C101.2 C102.2 C103.2 D10.1(K) R32.2 R33.1 R34.1 U12.4(GND) U13.27(TEST1) U13.28(TEST2) U13.40(TEST0) U13.49(EP) U14.1(A0) U14.2(A1) U14.3(A2) U14.4(VSS) U14.7(WP) Y1.2(GND) Y1.4(GND)
CM4_USB-FS_HUB_D_N: U13.3(USBDN_DM3) ; off-sheet CM4_USB-FS_DM  [also labelled CM4_USB-FS_DM]
CM4_USB-FS_HUB_D_P: U13.4(USBDN_DP3) ; off-sheet CM4_USB-FS_DP  [also labelled CM4_USB-FS_DP]
HUB_EEPROM_CS: R29.1 U12.1(~{CS}) U13.8(SPI_~{CE})
HUB_EEPROM_MISO: U12.2(SO/SIO1) U13.11(SPI_DI)
HUB_EEPROM_SCL: R36.1 U12.6(SCLK) U13.9(SPI_CLK/SCL_EP) U14.6(SCL)
HUB_EEPROM_SDA: R35.1 U12.5(SI/SIO0) U13.10(SPI_DO/SDA_EP/SPI_SPD_SEL) U14.5(SDA)
HUB_PRTCTL2: R38.2 U13.6(PRTCTL2)
HUB_PRTCTL3: R39.2 U13.7(PRTCTL3)
HUB_SDMMC1_CLK: U13.21(SD_CLK) ; off-sheet HUB_USB_SD1_CLK  [also labelled HUB_USB_SD1_CLK]
HUB_SDMMC1_CMD: U13.24(SD_CMD) ; off-sheet HUB_USB_SD1_CMD  [also labelled HUB_USB_SD1_CMD]
HUB_SDMMC1_D0: U13.18(SD_D0) ; off-sheet HUB_USB_SD1_D0  [also labelled HUB_USB_SD1_D0]
HUB_SDMMC1_D1: U13.17(SD_D1) ; off-sheet HUB_USB_SD1_D1  [also labelled HUB_USB_SD1_D1]
HUB_SDMMC1_D2: U13.33(SD_D2) ; off-sheet HUB_USB_SD1_D2  [also labelled HUB_USB_SD1_D2]
HUB_SDMMC1_D3: U13.32(SD_D3) ; off-sheet HUB_USB_SD1_D3  [also labelled HUB_USB_SD1_D3]
HUB_SDMMC1_D4: U13.30(SD_D4) ; off-sheet HUB_USB_SD1_D4  [also labelled HUB_USB_SD1_D4]
HUB_SDMMC1_D5: U13.23(SD_D5) ; off-sheet HUB_USB_SD1_D5  [also labelled HUB_USB_SD1_D5]
HUB_SDMMC1_D6: U13.20(SD_D6) ; off-sheet HUB_USB_SD1_D6  [also labelled HUB_USB_SD1_D6]
HUB_SDMMC1_D7: U13.19(SD_D7) ; off-sheet HUB_USB_SD1_D7  [also labelled HUB_USB_SD1_D7]
HUB_USB-FS_D_N: U13.43(USBUP_DM) ; off-sheet HUB_USB-FS_DM  [also labelled HUB_USB-FS_DM]
HUB_USB-FS_D_P: U13.42(USBUP_DP) ; off-sheet HUB_USB-FS_DP  [also labelled HUB_USB-FS_DP]
HUB_XTAL1: C85.2 R37.2 U13.45(XTAL1(CLKIN)) Y1.3(OUT/IN)
HUB_XTAL2: C84.2 R37.1 U13.44(XTAL2) Y1.1(IN/OUT)
MCU_DETECT_SD: R33.2 U13.14(SD_~{CD}) ; off-sheet MCU_IO_DETECT_SD  [also labelled MCU_IO_DETECT_SD]
MCU_IO_HUB_RESET: C76.1 R30.2 TP5.0 U13.38(~{RESET}) ; off-sheet MCU_IO_HUB_RESET
MCU_USB-FS_HUB_D_N: U13.1(USBDN_DM2) ; off-sheet MCU_USB-FS_DM  [also labelled MCU_USB-FS_DM]
MCU_USB-FS_HUB_D_P: U13.2(USBDN_DP2) ; off-sheet MCU_USB-FS_DP  [also labelled MCU_USB-FS_DP]
NetC71_1: C71.1 C73.2
NetC71_2: C71.2 C72.1 TP4.0 U13.15(VDD18)
NetC74_2: C74.2 C75.1
NetC77_1: C77.1 C79.2
NetC77_2: C77.2 C78.1 U13.46(VDD18PLL)
NetC80_2: C80.2 C81.1
NetC82_2: C82.2 C83.1
NetC86_2: C86.2 C96.1
NetC87_2: C87.2 C97.1
NetC88_2: C88.2 C98.1
NetC89_2: C89.2 C99.1
NetC90_2: C90.2 C100.1
NetC91_2: C91.2 C101.1
NetC92_2: C92.2 C102.1
NetC93_2: C93.2 C103.1
NetD10_2: D10.2(A) R31.1
NetR28_1: R28.1 U12.3(~{WP}) U12.7(~{HOLD})
NetR31_2: R31.2 U13.35(CRD_PWR)
NetR32_1: R32.1 U13.47(RBIAS)
NetR34_2: R34.2 U13.13(SD_WP)

Not connected (* = marked no-connect by the designer): U13 22(REG_EN)* 29(SDA)* 31(NC)* 36(SCL)* 37(GPO1)*

### Layout directives
net class 50_eMMC1_HUB: HUB_SDMMC1_CLK, HUB_SDMMC1_CMD, HUB_SDMMC1_D0, HUB_SDMMC1_D1, HUB_SDMMC1_D2, HUB_SDMMC1_D3, HUB_SDMMC1_D4, HUB_SDMMC1_D5, HUB_SDMMC1_D6, HUB_SDMMC1_D7, HUB_USB_SD1_CLK, HUB_USB_SD1_CMD, HUB_USB_SD1_D0, HUB_USB_SD1_D1, HUB_USB_SD1_D2, HUB_USB_SD1_D3, HUB_USB_SD1_D4, HUB_USB_SD1_D5, HUB_USB_SD1_D6, HUB_USB_SD1_D7
differential pair; differential pair class DIFF90: CM4_USB-FS_HUB_D_N, CM4_USB-FS_HUB_D_P, HUB_USB-FS_D_N, HUB_USB-FS_D_P, MCU_USB-FS_HUB_D_N, MCU_USB-FS_HUB_D_P

### Notes on the sheet
- Place Cap near Power Pin
- DNP
- Put at least 16Vias at GNDPAD
- [16]-16-34-25-12
- Pin 48 requires an external bypass capacitor of 4.7µF minimum.
- [48]-48-5-41
- Pin 16 requires an external bypass capacitor of 4.7µF minimum.
- 26
- Project:
- Sub-system:
- Design by:
- Sheet title:
- Sheet
- A3
- of
- Checked by:
- Approved by:
- Revision:
- Document No:
- Size:
- Date:
- (in symbol TACL335M003RTA) +

### Library data of the parts
C71 C73-C77 C79-C93 C96-C103 = Tu 0402 33nF 10V: as C1 on sheet obc-v2_POWER; Kieu_Chan: *
C72 C78 C94 C95 = TACL335M003RTA: CAPP; Package: None; Price: None; Value: *; MP: TACL335M003RTA; Availability: Unavailable
D10 = CMP-1426-00005-2: as D1 on sheet obc-v2_POWER; Case Code (Imperial): 0603; Height: 700µm; REACH SVHC: Unknown; Dominant Wavelength: 590nm; Min Operating Temperature: -40°C; Color: Yellow; Width: 800µm; Mount: Surface Mount; Packaging: Tape and Reel; Max Operating Temperature: 85°C; RoHS: Compliant; Max Reverse Voltage (DC): 5V; Case Code (Metric): 1608; Length: 1.6mm; Case/Package: 0603
R28-R31 R33-R36 R38 R39 = Tro 0603 1% 10k: as R1 on sheet obc-v2_POWER; Kieu_Chan: *
R32 R37 = Tro 0603 1% 1k: as R105 on sheet obc-v2_BOARD-CONNECT; Kieu_Chan: *
TP4 TP5 = Test Point: Solder: NF
U12 = MX25L8006EM1I-12G: as U11 on sheet obc-v2_FRAM-FLASH; SnapEDA_Link: https://www.snapeda.com/parts/MX25L8006EM1I-12G/Macronix/view-part/?ref=snap; Package: SOP-8 Macronix; Value: *; MP: MX25L8006EM1I-12G; Check_prices: https://www.snapeda.com/parts/MX25L8006EM1I-12G/Macronix/view-part/?ref=eda
U13 = CMP-06284-000083-1: IC INTERFACE SPECIALIZED 48QFN; Data Rate: 480Mbps; Interface: I2C; Number of Ports: 2; Operating Supply Voltage: 3.3V; Case/Package: QFN; Series: -; RoHS Compliant: Yes; Number of Pins: 48; Packaging: Tray; Package Quantity: 260; Max Operating Temperature: 85°C; Weight: 0.005309oz; Mount: Surface Mount; Min Operating Temperature: -40°C
U14 = CMP-0159-00349-1: 4Kbit, 400kHz, 2.5V, I2C Serial EEPROM, 8-Pin SOIC 150mil, Extended Temperature, Tape and Reel; Code_IPC: SOIC127P600-8; Code_JEDEC: MS-012; PackageVersion: revBB, Aug-2009; DatasheetVersion: revK, Mar-2009; PackageDescription: 8-Lead Plastic Small Outline (SN) - Narrow, 3.90mm Body [SOIC]; PackageReference: SOIC-SN8
Y1 = ECS-240-12-37B-CKY-TR: Package: None; Price: None; Value: *; MP: ECS-240-12-37B-CKY-TR; Availability: Unavailable

## Sheet obc-v2_EXP-I2C-IRQ.SchDoc
size 420 x 297 mm; SheetNumber: 13; SheetTotal: 23
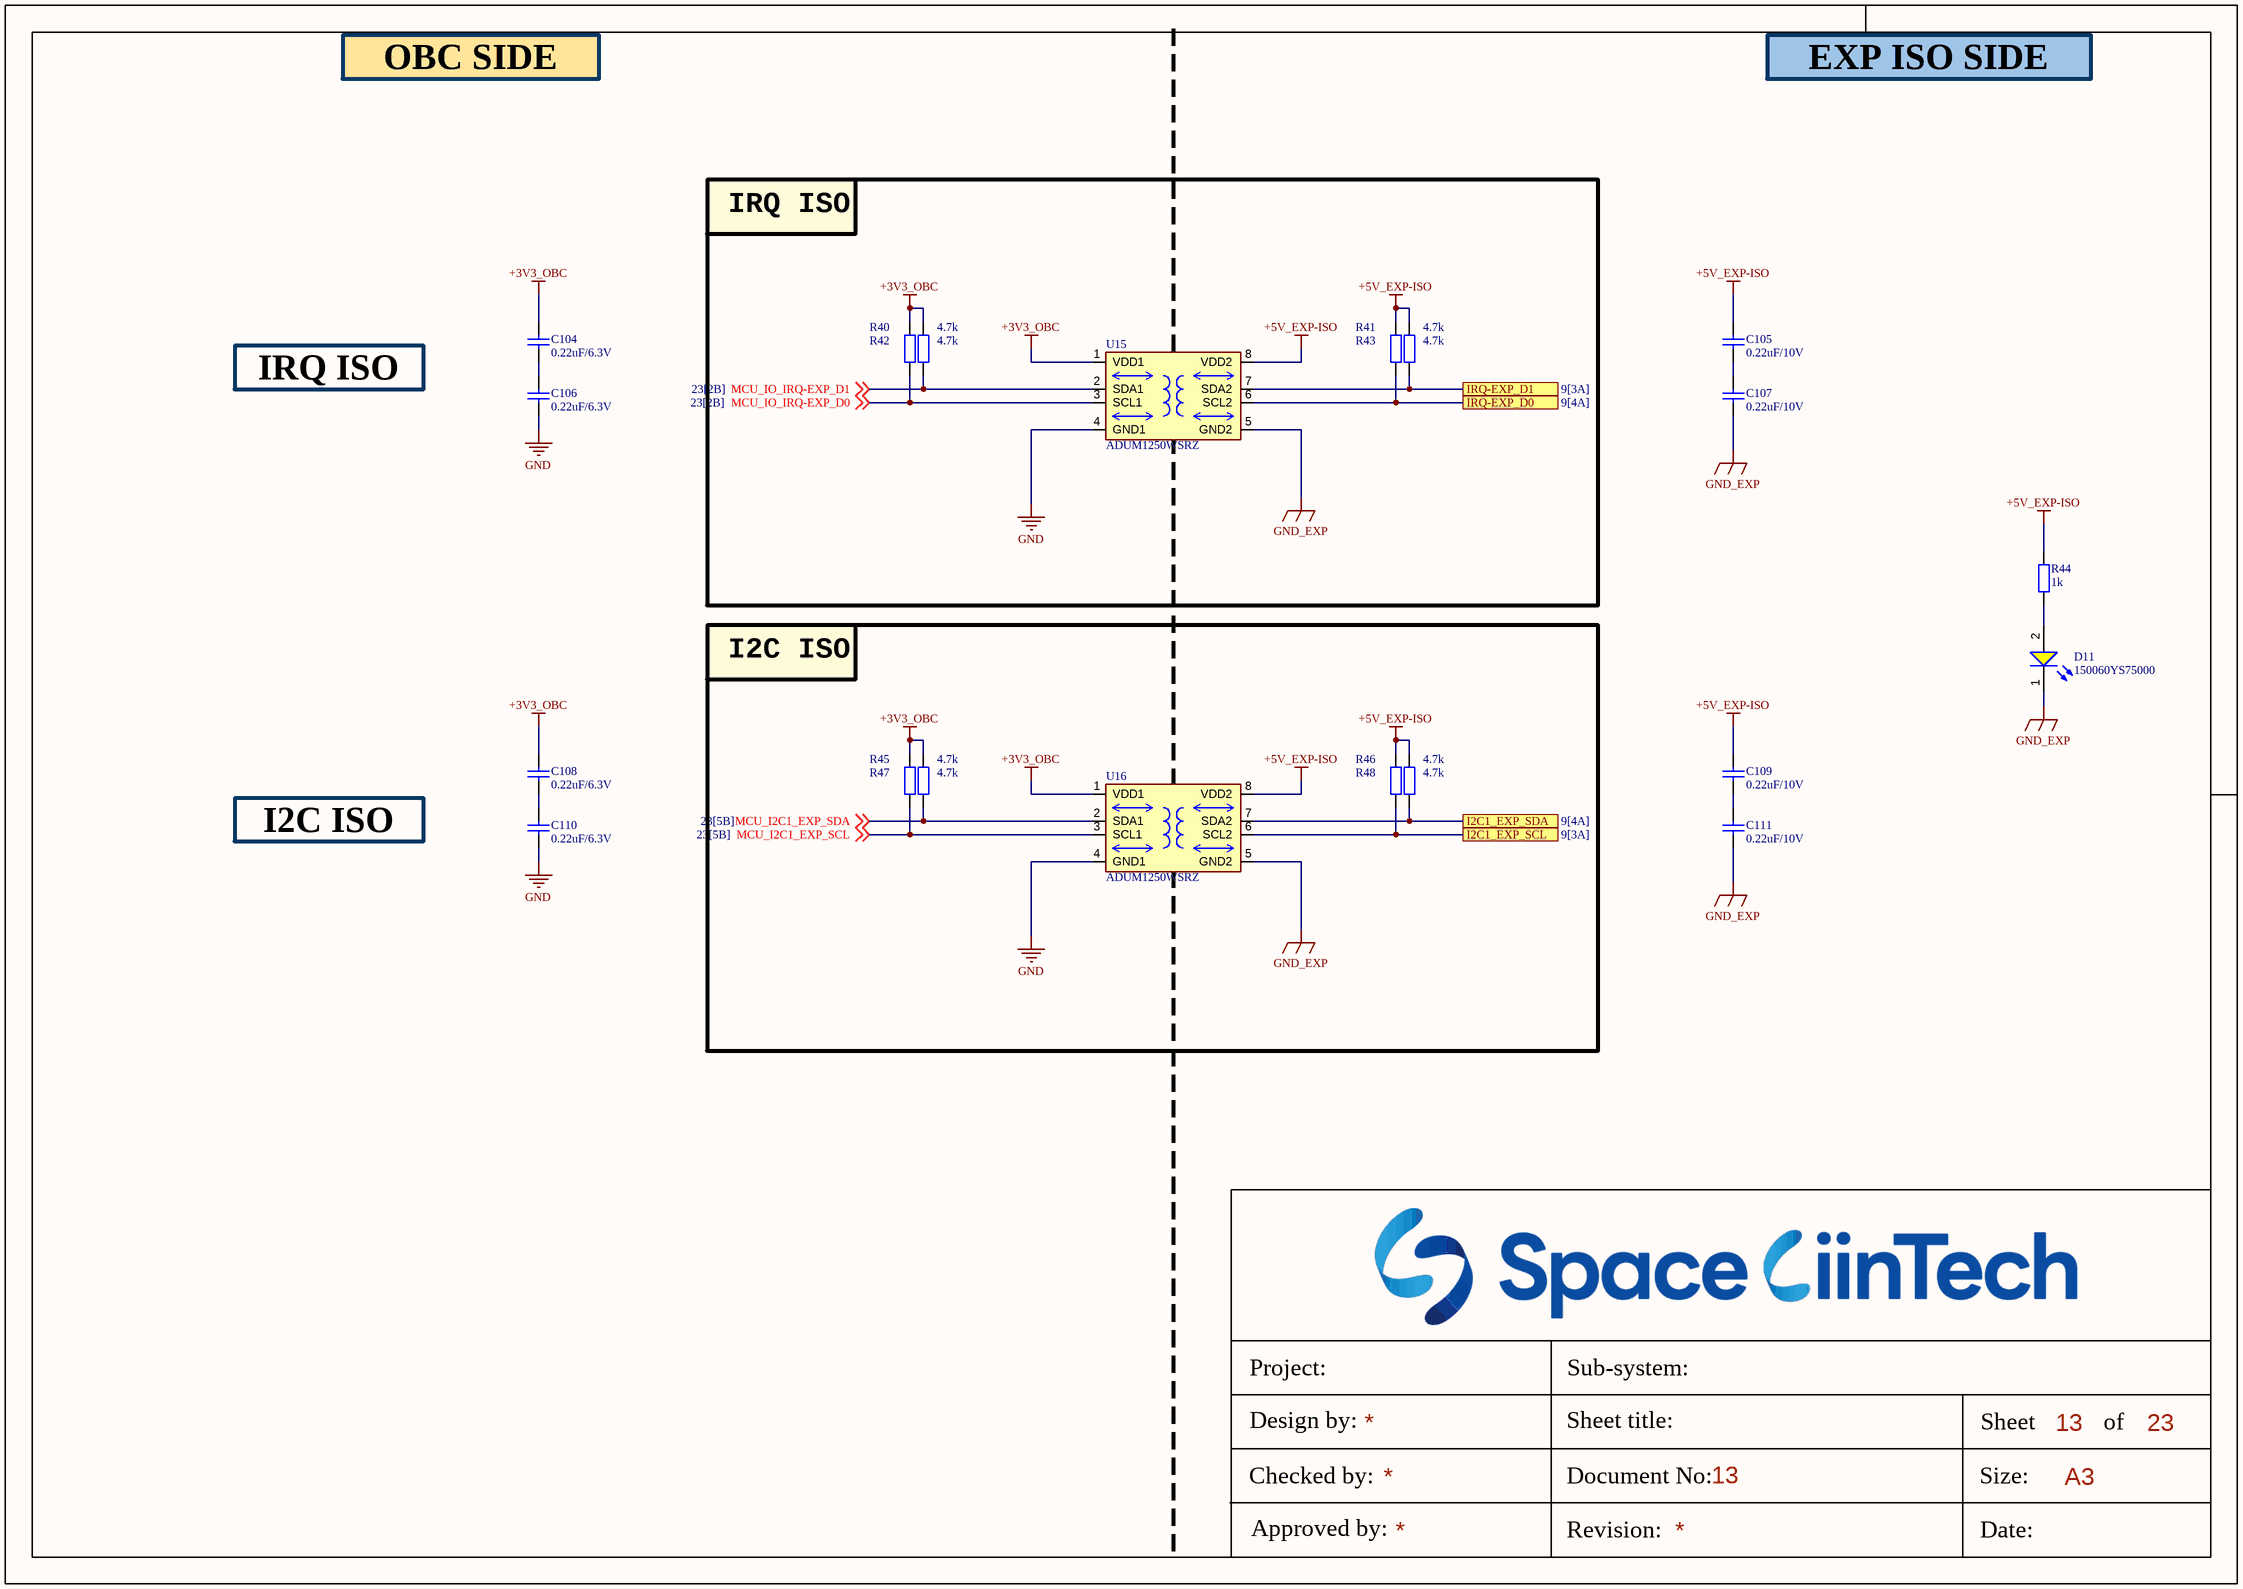
[diagram p11: obc-v2_EXP-I2C-IRQ.SchDoc]

### Parts
C104  0.22uF/6.3V  [CAP_C_1005X60]
C105  0.22uF/10V  [CAP_C_1005X60]
C106  0.22uF/6.3V  [CAP_C_1005X60]
C107  0.22uF/10V  [CAP_C_1005X60]
C108  0.22uF/6.3V  [CAP_C_1005X60]
C109  0.22uF/10V  [CAP_C_1005X60]
C110  0.22uF/6.3V  [CAP_C_1005X60]
C111  0.22uF/10V  [CAP_C_1005X60]
D11  150060YS75000  [WL-SMCW_0603_150060xx75000]
R40  4.7k  [RES_C_1608X60]
R41  4.7k  [RES_C_1608X60]
R42  4.7k  [RES_C_1608X60]
R43  4.7k  [RES_C_1608X60]
R44  1k  [RES_C_1608X60]
R45  4.7k  [RES_C_1608X60]
R46  4.7k  [RES_C_1608X60]
R47  4.7k  [RES_C_1608X60]
R48  4.7k  [RES_C_1608X60]
U15  ADUM1250WSRZ  [SOIC127P602X173-8N]
U16  ADUM1250WSRZ  [SOIC127P602X173-8N]

### Blocks framed on the sheet
IRQ ISO: R40-R43 U15
I2C ISO: R45-R48 U16

### Ports
I2C1_EXP_SCL (see 9[3A]), I2C1_EXP_SDA (see 9[4A]), IRQ-EXP_D0 (see 9[4A]), IRQ-EXP_D1 (see 9[3A])

### Nets
+3V3_OBC: C104.1 C108.1 R40.2 R42.2 R45.2 R47.2 U15.1(VDD1) U16.1(VDD1)
+5V_EXP-ISO: C105.1 C109.1 R41.2 R43.2 R44.2 R46.2 R48.2 U15.8(VDD2) U16.8(VDD2)
GND: C106.2 C110.2 U15.4(GND1) U16.4(GND1)
GND_EXP: C107.2 C111.2 D11.1(K) U15.5(GND2) U16.5(GND2)
MCU_I2C1_EXP_SCL: R45.1 U16.3(SCL1) ; off-sheet MCU_I2C1_EXP_SCL
MCU_I2C1_EXP_SDA: R47.1 U16.2(SDA1) ; off-sheet MCU_I2C1_EXP_SDA
MCU_IO_IRQ-EXP_D0: R40.1 U15.3(SCL1) ; off-sheet MCU_IO_IRQ-EXP_D0
MCU_IO_IRQ-EXP_D1: R42.1 U15.2(SDA1) ; off-sheet MCU_IO_IRQ-EXP_D1
NetC104_2: C104.2 C106.1
NetC105_2: C105.2 C107.1
NetC108_2: C108.2 C110.1
NetC109_2: C109.2 C111.1
NetD11_2: D11.2(A) R44.1
NetJ3_5: R46.1 U16.6(SCL2) ; port I2C1_EXP_SCL
NetJ3_8: R43.1 U15.7(SDA2) ; port IRQ-EXP_D1
NetJ3_26: R48.1 U16.7(SDA2) ; port I2C1_EXP_SDA
NetJ3_29: R41.1 U15.6(SCL2) ; port IRQ-EXP_D0

### Notes on the sheet
- OBC SIDE
- EXP ISO SIDE
- IRQ ISO
- I2C ISO
- Project:
- Sub-system:
- Design by:
- Sheet title:
- Sheet
- A3
- of
- Checked by:
- Approved by:
- Revision:
- Document No:
- Size:
- Date:

### Library data of the parts
C104-C111 = Tu 0402 33nF 10V: as C1 on sheet obc-v2_POWER; Kieu_Chan: *
D11 = CMP-1426-00005-2: as D1 on sheet obc-v2_POWER; Case Code (Imperial): 0603; Height: 700µm; REACH SVHC: Unknown; Dominant Wavelength: 590nm; Min Operating Temperature: -40°C; Color: Yellow; Width: 800µm; Mount: Surface Mount; Packaging: Tape and Reel; Max Operating Temperature: 85°C; RoHS: Compliant; Max Reverse Voltage (DC): 5V; Case Code (Metric): 1608; Length: 1.6mm; Case/Package: 0603
R40-R48 = Tro 0603 1% 10k: as R1 on sheet obc-v2_POWER; Kieu_Chan: *
U15 U16 = ADUM1250: IÂ²C Digital Isolator 2500Vrms 2 Channel 1Mbps 25kV/Âµs CMTI 8-SOIC (0.154", 3.90mm Width); MF: Analog Devices; Package: SOIC-8; Price: None; Value: *; SnapEDA_Link: https://www.snapeda.com/parts/ADUM1250/Analog+Devices/view-part/?ref=snap; MP: ADUM1250; Availability: Unavailable; Check_prices: https://www.snapeda.com/parts/ADUM1250/Analog+Devices/view-part/?ref=eda

## Sheet obc-v2_EXP-CAN-RS422.SchDoc
size 420 x 297 mm; SheetNumber: 14; SheetTotal: 23
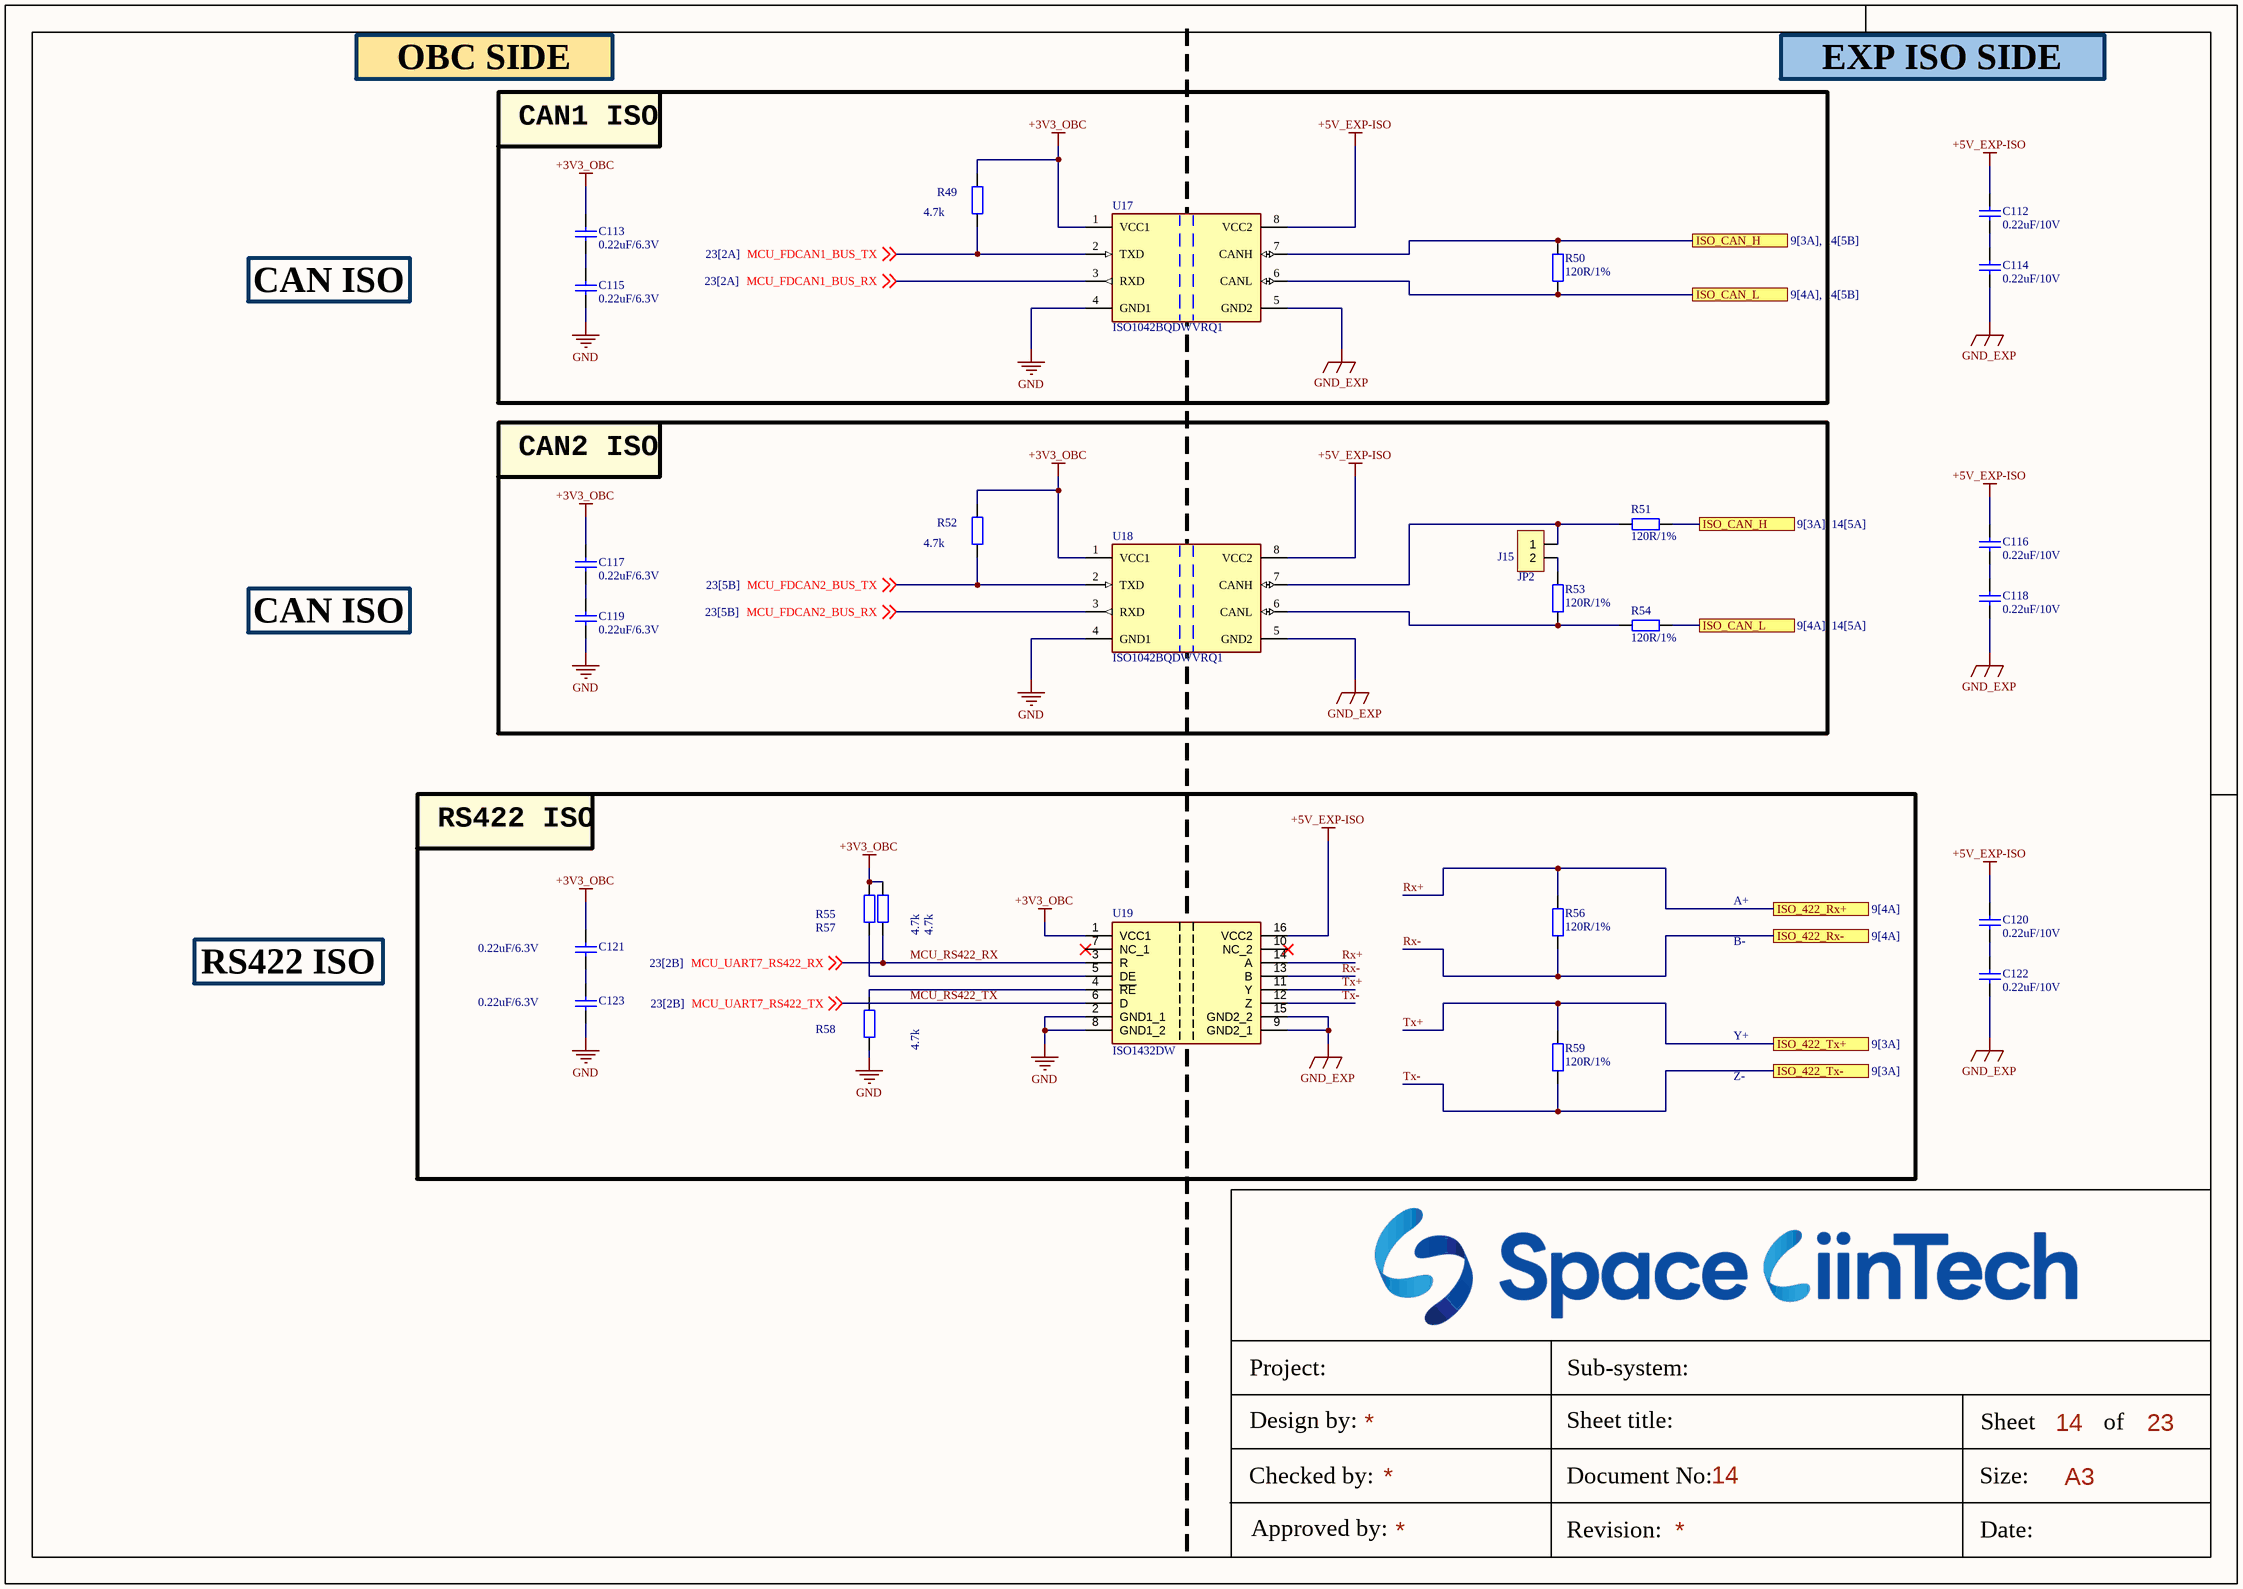
[diagram p12: obc-v2_EXP-CAN-RS422.SchDoc]

### Parts
C112  0.22uF/10V  [CAP_C_1005X60]
C113  0.22uF/6.3V  [CAP_C_1005X60]
C114  0.22uF/10V  [CAP_C_1005X60]
C115  0.22uF/6.3V  [CAP_C_1005X60]
C116  0.22uF/10V  [CAP_C_1005X60]
C117  0.22uF/6.3V  [CAP_C_1005X60]
C118  0.22uF/10V  [CAP_C_1005X60]
C119  0.22uF/6.3V  [CAP_C_1005X60]
C120  0.22uF/10V  [CAP_C_1005X60]
C121  0.22uF/6.3V  [CAP_C_1005X60]
C122  0.22uF/10V  [CAP_C_1005X60]
C123  0.22uF/6.3V  [CAP_C_1005X60]
J15  JP2  [JP2-D1T]
R49  4.7k  [RES_C_1608X60]
R50  120R/1%  [RES_C_1608X60]
R51  120R/1%  [RES_C_1608X60]
R52  4.7k  [RES_C_1608X60]
R53  120R/1%  [RES_C_1608X60]
R54  120R/1%  [RES_C_1608X60]
R55  4.7k  [RES_C_1608X60]
R56  120R/1%  [RES_C_1608X60]
R57  4.7k  [RES_C_1608X60]
R58  4.7k  [RES_C_1608X60]
R59  120R/1%  [RES_C_1608X60]
U17  ISO1042BQDWVRQ1  [FP-DWV0008A-IPC_B]
U18  ISO1042BQDWVRQ1  [FP-DWV0008A-IPC_B]
U19  ISO1432DW  [SOIC127P1030X265-16N]

### Blocks framed on the sheet
CAN1 ISO: C113 C115 R49 R50 U17
CAN2 ISO: C117 C119 J15 R51-R54 U18
RS422 ISO: C121 C123 R55-R59 U19

### Ports
ISO_422_Rx+ (see 9[4A]), ISO_422_Rx- (see 9[4A]), ISO_422_Tx+ (see 9[3A]), ISO_422_Tx- (see 9[3A]), ISO_CAN_H (see 9[3A], 14[5A]), ISO_CAN_H (see 9[3A], 14[5B]), ISO_CAN_L (see 9[4A], 14[5A]), ISO_CAN_L (see 9[4A], 14[5B])

### Nets
+3V3_OBC: C113.1 C117.1 C121.1 R49.2 R52.2 R55.2 R57.2 U17.1(VCC1) U18.1(VCC1) U19.1(VCC1)
+5V_EXP-ISO: C112.1 C116.1 C120.2 U17.8(VCC2) U18.8(VCC2) U19.16(VCC2)
GND: C115.2 C119.2 C123.2 R58.1 U17.4(GND1) U18.4(GND1) U19.2(GND1_1) U19.8(GND1_2)
GND_EXP: C114.2 C118.2 C122.1 U17.5(GND2) U18.5(GND2) U19.9(GND2_1) U19.15(GND2_2)
MCU_FDCAN1_BUS_RX: U17.3(RXD) ; off-sheet MCU_FDCAN1_BUS_RX
MCU_FDCAN1_BUS_TX: R49.1 U17.2(TXD) ; off-sheet MCU_FDCAN1_BUS_TX
MCU_FDCAN2_BUS_RX: U18.3(RXD) ; off-sheet MCU_FDCAN2_BUS_RX
MCU_FDCAN2_BUS_TX: R52.1 U18.2(TXD) ; off-sheet MCU_FDCAN2_BUS_TX
MCU_RS422_RX: R57.1 U19.3(R) ; off-sheet MCU_UART7_RS422_RX  [also labelled MCU_UART7_RS422_RX]
MCU_RS422_TX: U19.6(D) ; off-sheet MCU_UART7_RS422_TX  [also labelled MCU_UART7_RS422_TX]
Rx+: R56.2 U19.14(A) ; port ISO_422_Rx+
Rx-: R56.1 U19.13(B) ; port ISO_422_Rx-
Tx+: R59.2 U19.11(Y) ; port ISO_422_Tx+
Tx-: R59.1 U19.12(Z) ; port ISO_422_Tx-
NetC112_2: C112.2 C114.1
NetC113_2: C113.2 C115.1
NetC116_2: C116.2 C118.1
NetC117_2: C117.2 C119.1
NetC120_1: C120.1 C122.2
NetC121_2: C121.2 C123.1
NetJ3_4: R50.2 R51.1 U17.7(CANH) ; port ISO_CAN_H
NetJ3_25: R50.1 R54.1 U17.6(CANL) ; port ISO_CAN_L
NetJ15_1: J15.1 R51.2 U18.7(CANH)
NetJ15_2: J15.2 R53.2
NetR53_1: R53.1 R54.2 U18.6(CANL)
NetR55_1: R55.1 U19.5(DE)
NetR58_2: R58.2 U19.4(~{RE})

Not connected (* = marked no-connect by the designer): U19 7(NC_1)* 10(NC_2)*

### Notes on the sheet
- OBC SIDE
- EXP ISO SIDE
- CAN ISO
- A+
- RS422 ISO
- B-
- Y+
- Z-
- Project:
- Sub-system:
- Design by:
- Sheet title:
- Sheet
- A3
- of
- Checked by:
- Approved by:
- Revision:
- Document No:
- Size:
- Date:

### Library data of the parts
C112-C123 = Tu 0402 33nF 10V: as C1 on sheet obc-v2_POWER; Kieu_Chan: *
J15 = JP2: WR-PHD 2.54 mm Angled Socket Header; Manufacturer: W¨¹rth Elektronik eiSos GmbH; partNo: 613002143121; ComponentLink1 Description: Manufacturer; ComponentLink2 Description: Datasheet; NoPins: 02; Created Date: 29 March 2013; ComponentLink1URL: http://www.we-online.com; ComponentLink2URL: http://katalog.we-online.de/em/datasheet/6130xx143121.pdf; Created by: Karrer Zheng
R49-R59 = Tro 0603 1% 10k: as R1 on sheet obc-v2_POWER; Kieu_Chan: *
U17 U18 = CMP-04872-000086-1: TRANSCEIVER; RoHS Compliant: Yes
U19 = ISO1432DWR: RS-422/RS-485 Interface IC 5-kVrms isolated RS-485/RS-422 transceiver with robust EMC 16-SOIC -40 to 125; Manufacturer_Name: Texas Instruments; Manufacturer_Part_Number: ISO1430DW; Geometry.Height: 2.65mm; Mouser Part Number: 595-ISO1430DW; Mouser Price/Stock: https://www.mouser.co.uk/ProductDetail/Texas-Instruments/ISO1430DW?qs=EBDBlbfErPzpJh5zkcdiFg%3D%3D; Arrow Part Number: ISO1430DW; Arrow Price/Stock: https://www.arrow.com/en/products/iso1430dw/texas-instruments?region=nac; Datasheet Link: https://datasheet.datasheetarchive.com/originals/distributors/Datasheets_SAMA/30467ff99f72399b87c3bb1b8b60cbd8.pdf